# Altium project slave-12-ltc6811-1.PrjPcb (part 2 of 4)

## Sheet feedback.SchDoc: foxBMS BMS-Slave 12-Cell
size A3; DocumentNumber: 8; SheetNumber: 8; SheetTotal: 21; AUTHOR: Fraunhofer IISB foxBMS Team; SheetDescription: Passive Balancing Feedback
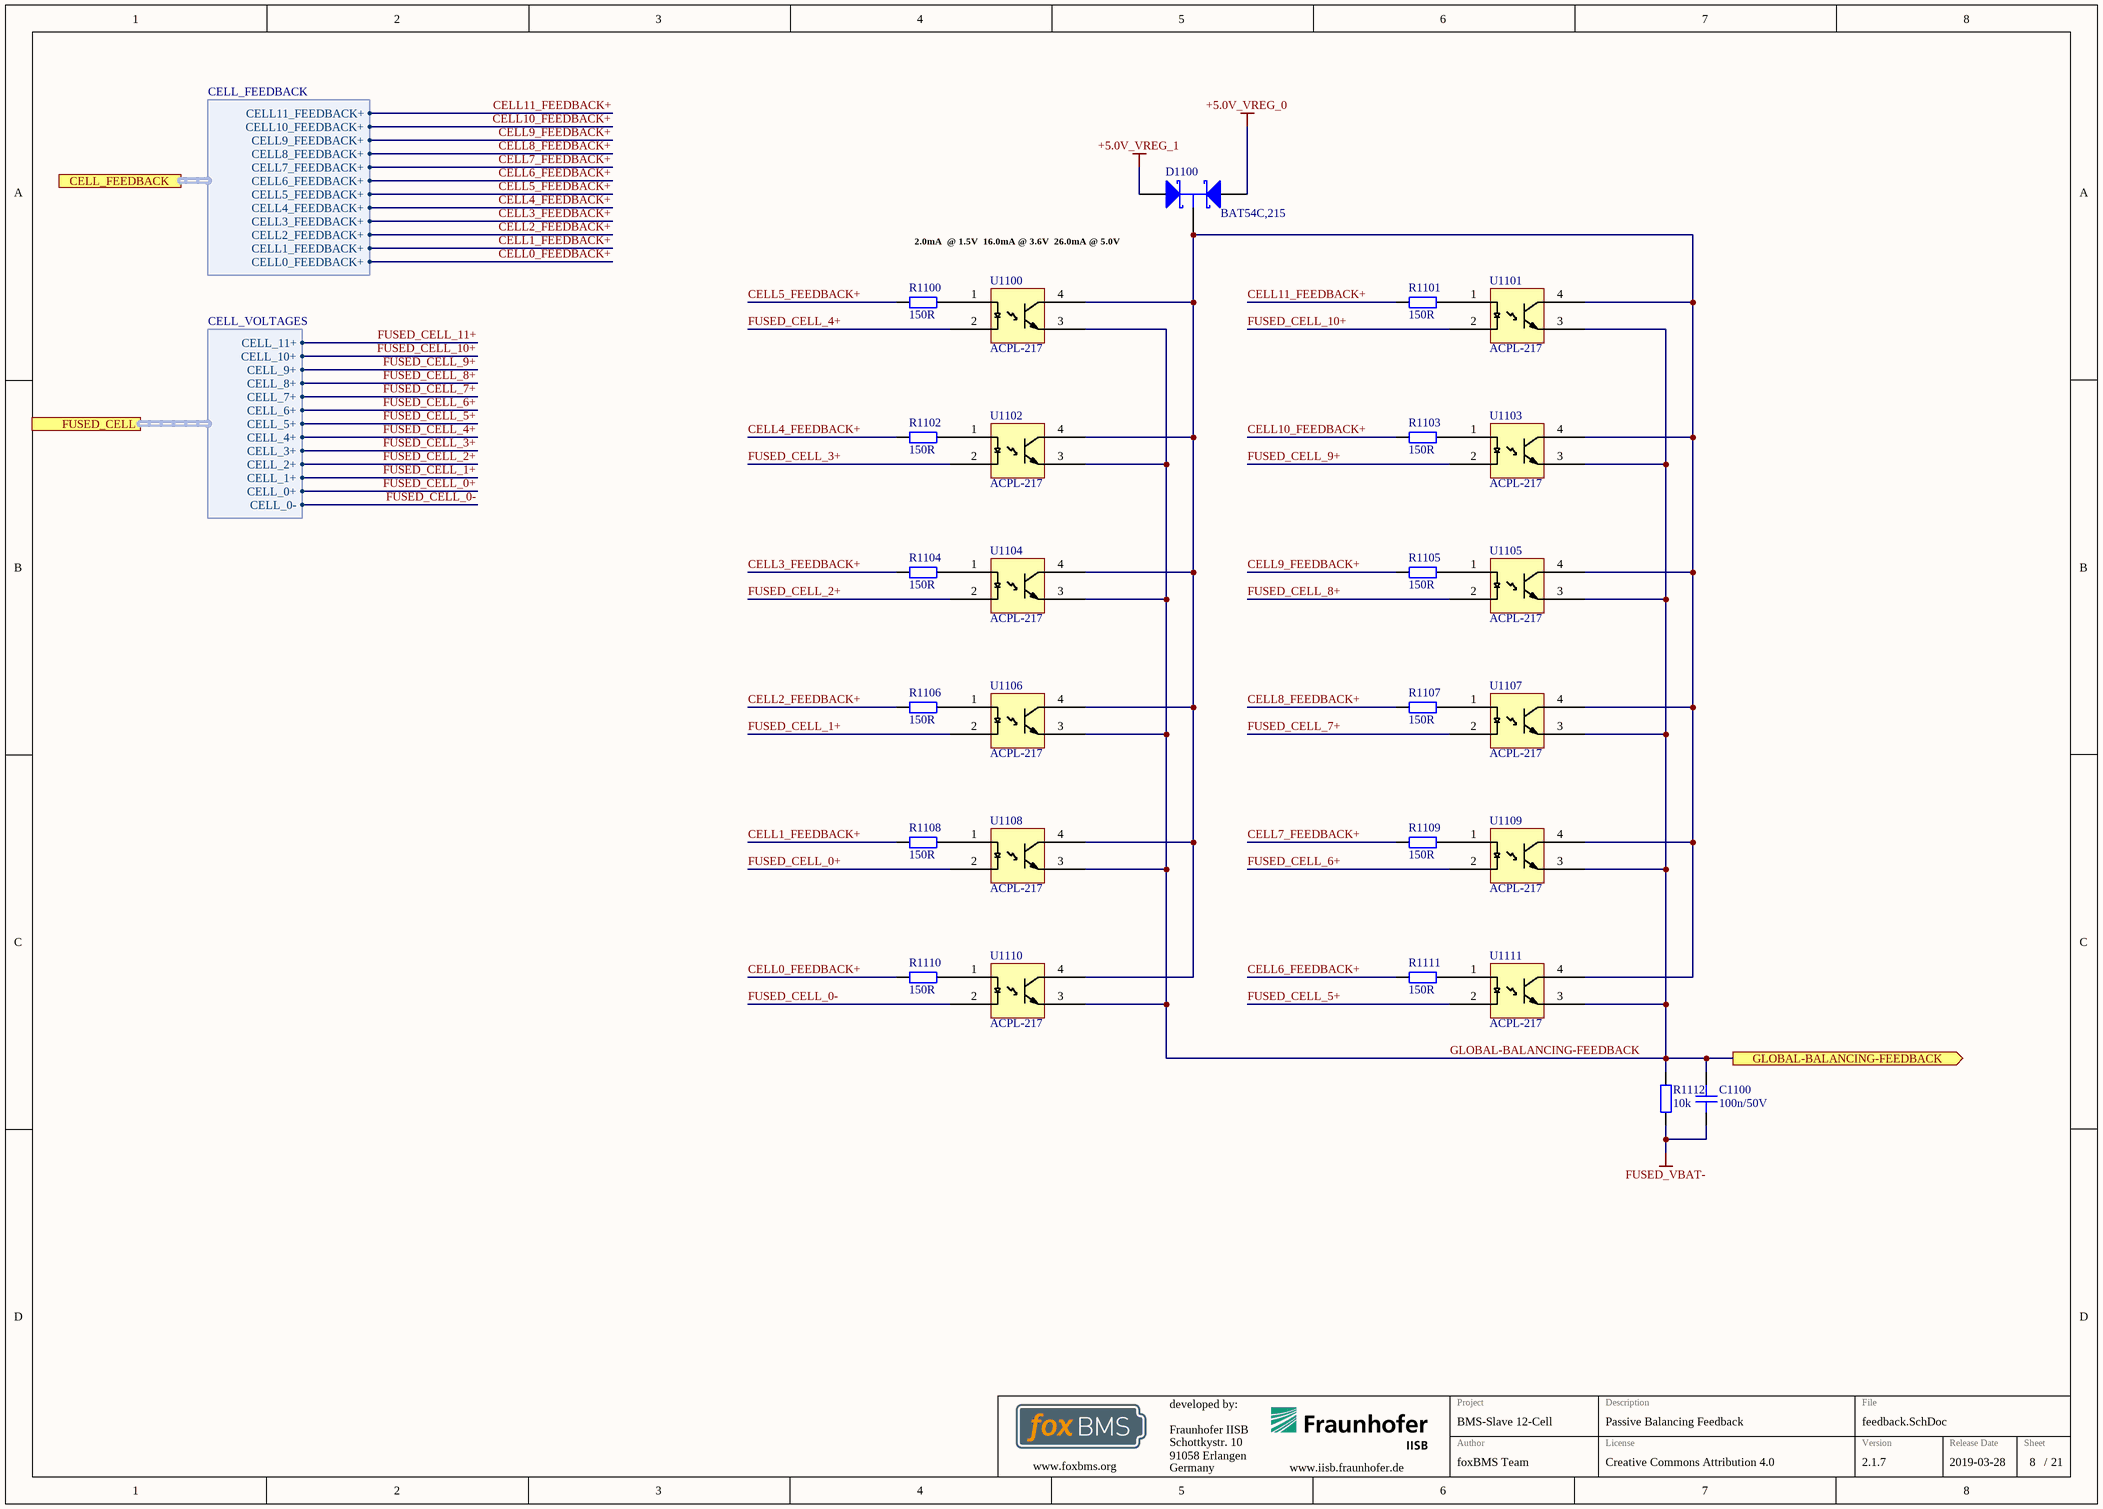
[diagram p6: feedback.SchDoc]

### Parts
C1100  100n/50V  [CAPC1608X08N]
D1100  BAT54C,215  [NXP-SOT23-3_V]
R1100  150R  [RESC1608X05N]
R1101  150R  [RESC1608X05N]
R1102  150R  [RESC1608X05N]
R1103  150R  [RESC1608X05N]
R1104  150R  [RESC1608X05N]
R1105  150R  [RESC1608X05N]
R1106  150R  [RESC1608X05N]
R1107  150R  [RESC1608X05N]
R1108  150R  [RESC1608X05N]
R1109  150R  [RESC1608X05N]
R1110  150R  [RESC1608X05N]
R1111  150R  [RESC1608X05N]
R1112  10k  [RESC1608X05N]
U1100  ACPL-217  [SOIC127P700X220-4N]
U1101  ACPL-217  [SOIC127P700X220-4N]
U1102  ACPL-217  [SOIC127P700X220-4N]
U1103  ACPL-217  [SOIC127P700X220-4N]
U1104  ACPL-217  [SOIC127P700X220-4N]
U1105  ACPL-217  [SOIC127P700X220-4N]
U1106  ACPL-217  [SOIC127P700X220-4N]
U1107  ACPL-217  [SOIC127P700X220-4N]
U1108  ACPL-217  [SOIC127P700X220-4N]
U1109  ACPL-217  [SOIC127P700X220-4N]
U1110  ACPL-217  [SOIC127P700X220-4N]
U1111  ACPL-217  [SOIC127P700X220-4N]

### Ports
CELL_FEEDBACK (harness CELL_FEEDBACK), FUSED_CELL (harness CELL_VOLTAGES), GLOBAL-BALANCING-FEEDBACK (out)

### Harnesses
CELL_FEEDBACK: CELL11_FEEDBACK+, CELL10_FEEDBACK+, CELL9_FEEDBACK+, CELL8_FEEDBACK+, CELL7_FEEDBACK+, CELL6_FEEDBACK+, CELL5_FEEDBACK+, CELL4_FEEDBACK+, CELL3_FEEDBACK+, CELL2_FEEDBACK+, CELL1_FEEDBACK+, CELL0_FEEDBACK+
CELL_VOLTAGES: CELL_0-, CELL_0+, CELL_1+, CELL_10+, CELL_11+, CELL_2+, CELL_3+, CELL_4+, CELL_5+, CELL_6+, CELL_7+, CELL_8+, CELL_9+

### Nets
+5.0V_VREG_0: D1100.2(A)
+5.0V_VREG_1: D1100.1(A)
FUSED_VBAT-: C1100.1 R1112.2
CELL0_FEEDBACK+: R1110.1 ; port CELL_FEEDBACK.CELL0_FEEDBACK+
CELL1_FEEDBACK+: R1108.1 ; port CELL_FEEDBACK.CELL1_FEEDBACK+
CELL2_FEEDBACK+: R1106.1 ; port CELL_FEEDBACK.CELL2_FEEDBACK+
CELL3_FEEDBACK+: R1104.1 ; port CELL_FEEDBACK.CELL3_FEEDBACK+
CELL4_FEEDBACK+: R1102.1 ; port CELL_FEEDBACK.CELL4_FEEDBACK+
CELL5_FEEDBACK+: R1100.1 ; port CELL_FEEDBACK.CELL5_FEEDBACK+
CELL6_FEEDBACK+: R1111.1 ; port CELL_FEEDBACK.CELL6_FEEDBACK+
CELL7_FEEDBACK+: R1109.1 ; port CELL_FEEDBACK.CELL7_FEEDBACK+
CELL8_FEEDBACK+: R1107.1 ; port CELL_FEEDBACK.CELL8_FEEDBACK+
CELL9_FEEDBACK+: R1105.1 ; port CELL_FEEDBACK.CELL9_FEEDBACK+
CELL10_FEEDBACK+: R1103.1 ; port CELL_FEEDBACK.CELL10_FEEDBACK+
CELL11_FEEDBACK+: R1101.1 ; port CELL_FEEDBACK.CELL11_FEEDBACK+
FUSED_CELL_0+: U1108.2 ; port FUSED_CELL.CELL_0+
FUSED_CELL_0-: U1110.2 ; port FUSED_CELL.CELL_0-
FUSED_CELL_1+: U1106.2 ; port FUSED_CELL.CELL_1+
FUSED_CELL_2+: U1104.2 ; port FUSED_CELL.CELL_2+
FUSED_CELL_3+: U1102.2 ; port FUSED_CELL.CELL_3+
FUSED_CELL_4+: U1100.2 ; port FUSED_CELL.CELL_4+
FUSED_CELL_5+: U1111.2 ; port FUSED_CELL.CELL_5+
FUSED_CELL_6+: U1109.2 ; port FUSED_CELL.CELL_6+
FUSED_CELL_7+: U1107.2 ; port FUSED_CELL.CELL_7+
FUSED_CELL_8+: U1105.2 ; port FUSED_CELL.CELL_8+
FUSED_CELL_9+: U1103.2 ; port FUSED_CELL.CELL_9+
FUSED_CELL_10+: U1101.2 ; port FUSED_CELL.CELL_10+
GLOBAL-BALANCING-FEEDBACK: C1100.2 R1112.1 U1100.3 U1101.3 U1102.3 U1103.3 U1104.3 U1105.3 U1106.3 U1107.3 U1108.3 U1109.3 U1110.3 U1111.3 ; port GLOBAL-BALANCING-FEEDBACK
NetD1100_3: D1100.3(K) U1100.4 U1101.4 U1102.4 U1103.4 U1104.4 U1105.4 U1106.4 U1107.4 U1108.4 U1109.4 U1110.4 U1111.4
NetR1100_2: R1100.2 U1100.1
NetR1101_2: R1101.2 U1101.1
NetR1102_2: R1102.2 U1102.1
NetR1103_2: R1103.2 U1103.1
NetR1104_2: R1104.2 U1104.1
NetR1105_2: R1105.2 U1105.1
NetR1106_2: R1106.2 U1106.1
NetR1107_2: R1107.2 U1107.1
NetR1108_2: R1108.2 U1108.1
NetR1109_2: R1109.2 U1109.1
NetR1110_2: R1110.2 U1110.1
NetR1111_2: R1111.2 U1111.1

### Notes on the sheet
- 2.0mA  @ 1.5V
  16.0mA @ 3.6V
  26.0mA @ 5.0V
- Fraunhofer IISB
- Schottkystr. 10
- developed by:
- 91058 Erlangen
- Germany
- Author
- Project
- License
- Description
- File
- Version
- Release Date
- Sheet
- www.foxbms.org
- www.iisb.fraunhofer.de
- foxBMS Team
- /

### Library data of the parts
C1100 = gen_C_ceramic_100n_50V_X7R_0603: MLCC; Capacitance: 100n; Rated Voltage: 50V; Dielectric: X7R; Case EIA: 0603; Case Metric: 1608; PnP Package: C_0603_10; PnP Value: 100n/50V/X7R; PnP equipped: x; Automotive Qualified: False; Part Number: gen_C_ceramic_100n_50V_X7R_0603; Supplier 1: Farnell; Supplier Part Number 1: 2525267; Supplier 2: Digikey; Supplier Part Number 2: 490-6049-1-ND
D1100 = CMP-2000-04915-1: Schottky Barrier Diode, 30 V, 3-Pin SOT23, RoHS, Tape and Reel; Manufacturer: NXP Semiconductors; Forward Surge Current Ifsm Max: 600mA; Pin Configuration: 1A1,2A2,3comK; Package Version: Feb-16; Forward Voltage VF Max: 800mV; SMD Marking: L43/*W1; Diode Case Style: SOT-23; Reverse Recovery Time trr Typ: 5ns; Forward Current If(AV): 200mA; Reel Quantity: 3000; SVHC: NoSVHC(19-Dec-2012); No. of Pins: 3; Junction Temperature Tj Max: 125degC; Common Connection: Cathode; Repetitive Reverse Voltage Vrrm Max: 30V; Operating Temperature Max: 150degC; Operating Temperature Range: -65degCto+150degC; Termination Type: SMD; Package Description: 3-Pin Small Outline Transistor, Body 1.3 x 2.9 mm, Pitch 0.95 mm; Package / Case: SOT-23; Diode Type: Schottky; Manufacturer URL: http://www.nxp.com/; Tape Width: 8mm; Package Reference: SOT23-3; Datasheet URL: https://datasheet.ciiva.com/33723/1668625-33723936.pdf; Datasheet Version: Rev. 5 , 10/2012; Operating Temperature Min: -65degC; Current Ifsm: 600mA; Reverse Recovery Time trr Max: 5ns; Package URL: http://www.nxp.com/documents/outline_drawing/SOT23.pdf; Forward Voltage: 800mV
R1100-R1111 = gen_R_150R_0603: SMD Resistor 150R 0603; Tolerance: 1%; Power: 0.1W; Case EIA: 0603; Case Metric: 1608; Maximum Working Voltage: 75V; PnP Package: R_0603; Automotive Qualified: False; Part Number: gen_R_150R_0603; Operating Temperature: -55°C - +155°C; Resistance: 150R; Series: E24, E96; PnP Value: 150R; Supplier 1: Farnell; Supplier Part Number 1: 1469760
R1112 = gen_R_10k_0603: as R904 on sheet ext_supply; Part Number: gen_R_10k_0603; Operating Temperature: -55°C - +155°C; Resistance: 10k; Series: E24, E96; PnP Value: 10k; Supplier 1: Farnell; Supplier Part Number 1: 2073349
U1100-U1111 = ACPL-217-56BE: Optocoupler, Transistor Output, 1 Channel; Manufacturer: Broadcom Limited; Automotive Qualified: False; Part Number: ACPL-217-56BE; Part Name: ACPL-217; Operating Temperature: -55°C - +110°C; ComponentLink1Description: Datenblatt; ComponentLink1URL: http://www.farnell.com/datasheets/45634.pdf; Supplier 1: Farnell; Supplier Part Number 1: 1602623

## Sheet passive_balancing.SchDoc: foxBMS BMS-Slave 12-Cell
size A3; DocumentNumber: 9; SheetNumber: 9; SheetTotal: 21; AUTHOR: Fraunhofer IISB foxBMS Team; SheetDescription: Passive Cell Balancing
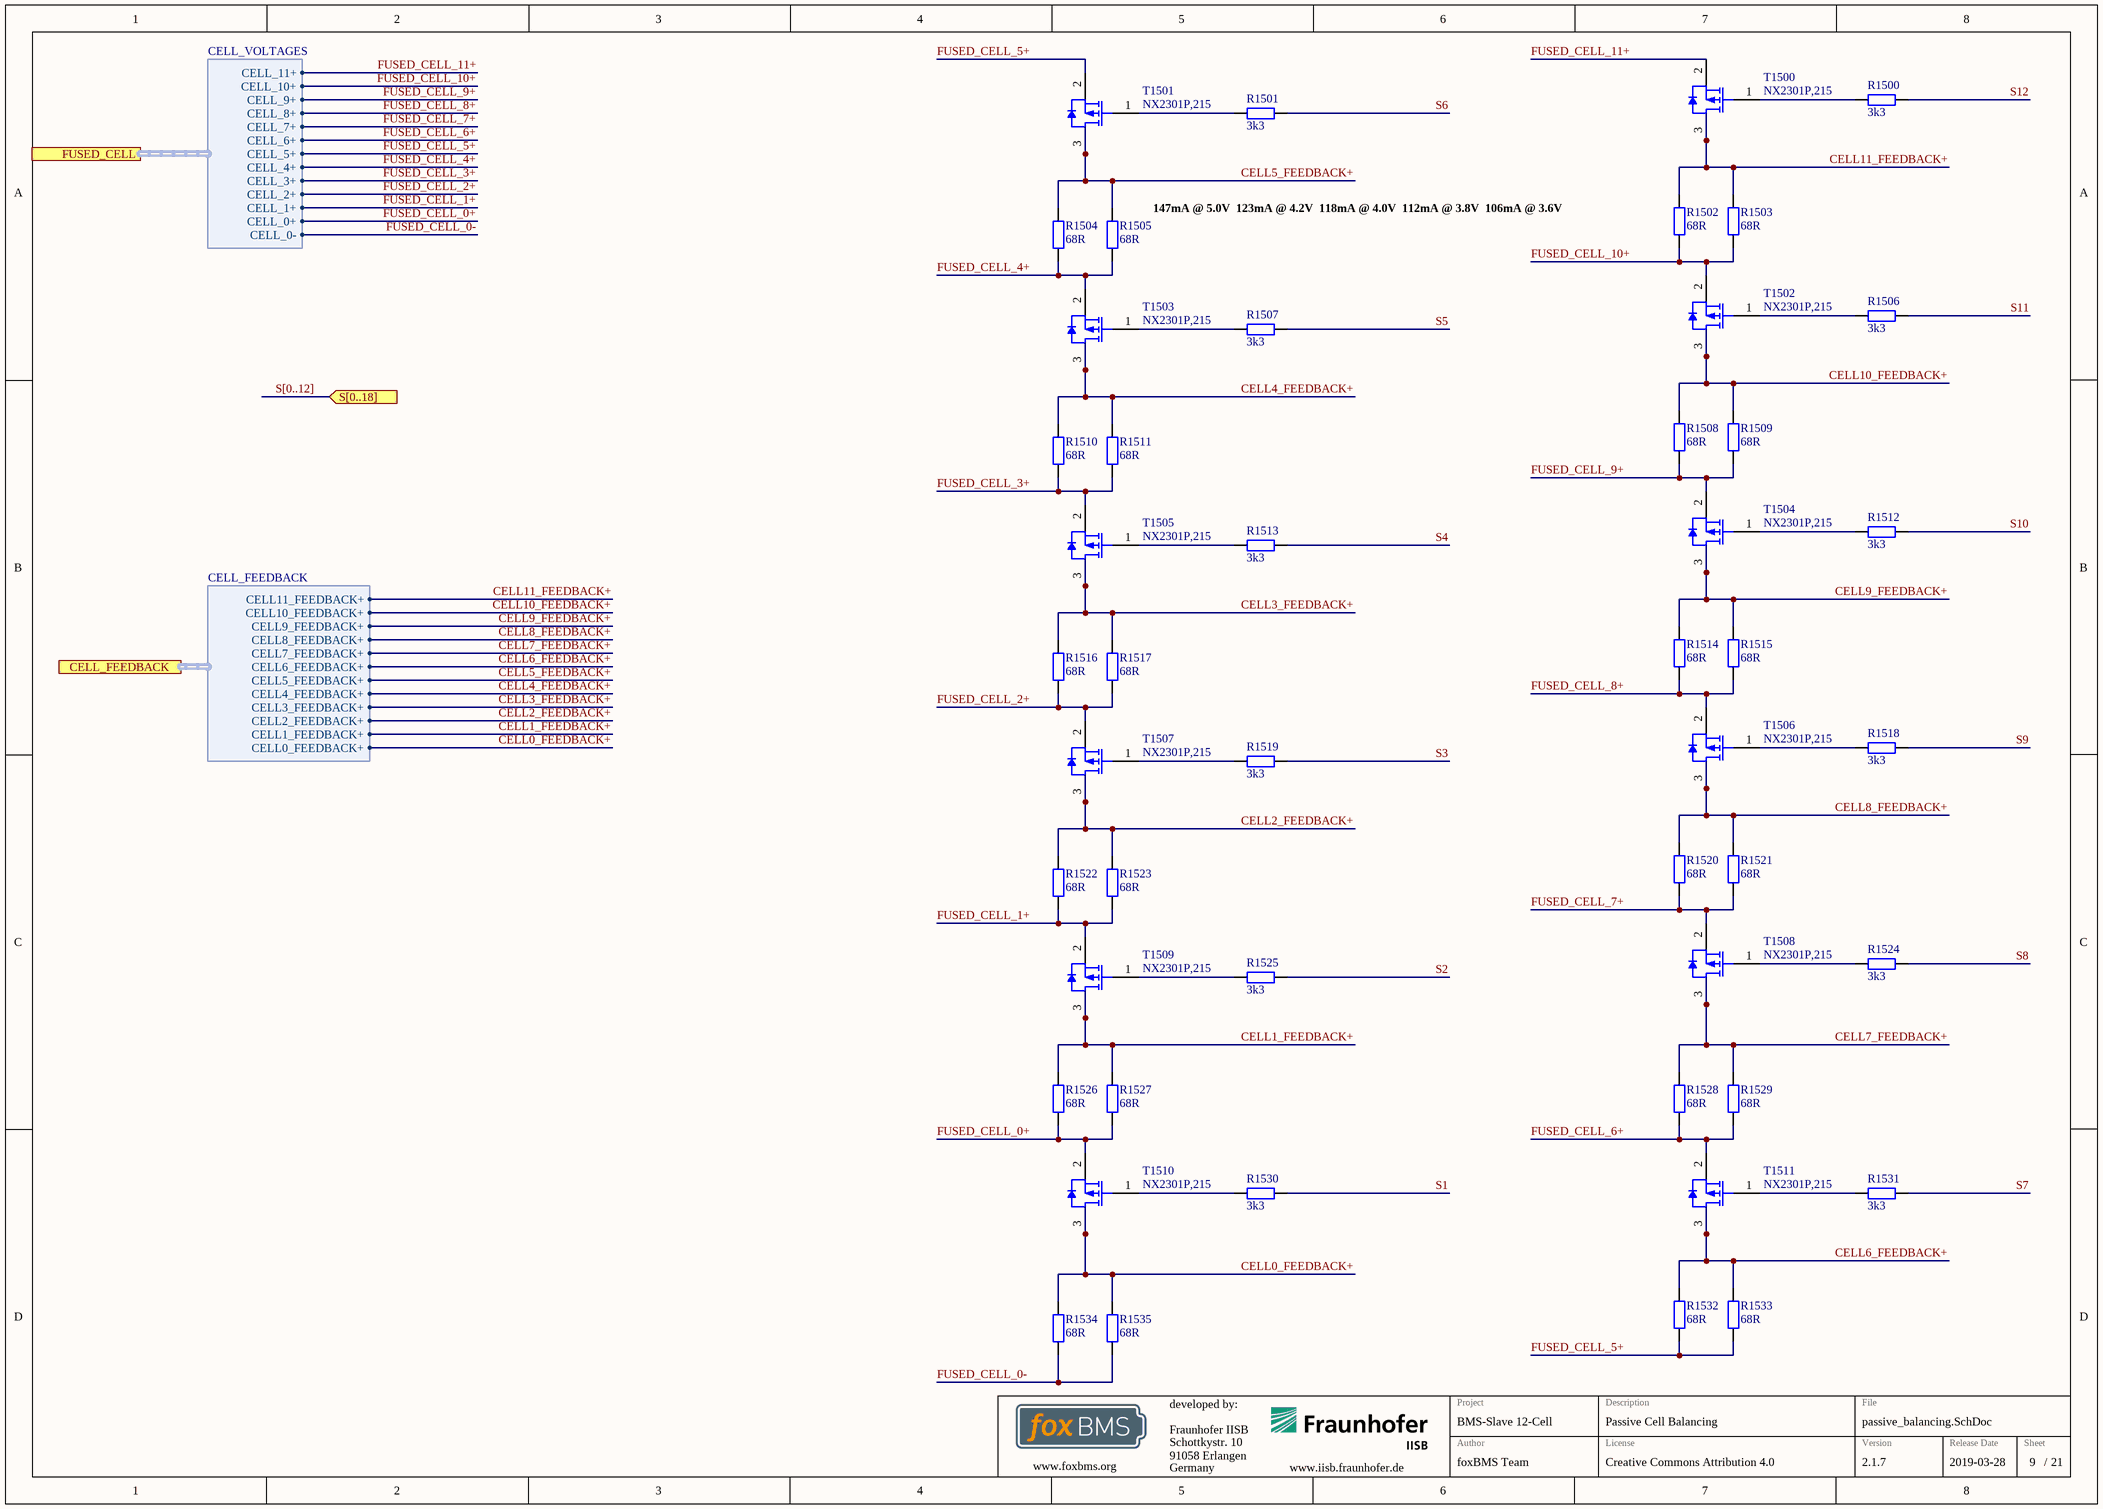
[diagram p7: passive_balancing.SchDoc]

### Parts
R1500  3k3  [RESC1608X05N]
R1501  3k3  [RESC1608X05N]
R1502  68R  [RESC5025X07N]
R1503  68R  [RESC5025X07N]
R1504  68R  [RESC5025X07N]
R1505  68R  [RESC5025X07N]
R1506  3k3  [RESC1608X05N]
R1507  3k3  [RESC1608X05N]
R1508  68R  [RESC5025X07N]
R1509  68R  [RESC5025X07N]
R1510  68R  [RESC5025X07N]
R1511  68R  [RESC5025X07N]
R1512  3k3  [RESC1608X05N]
R1513  3k3  [RESC1608X05N]
R1514  68R  [RESC5025X07N]
R1515  68R  [RESC5025X07N]
R1516  68R  [RESC5025X07N]
R1517  68R  [RESC5025X07N]
R1518  3k3  [RESC1608X05N]
R1519  3k3  [RESC1608X05N]
R1520  68R  [RESC5025X07N]
R1521  68R  [RESC5025X07N]
R1522  68R  [RESC5025X07N]
R1523  68R  [RESC5025X07N]
R1524  3k3  [RESC1608X05N]
R1525  3k3  [RESC1608X05N]
R1526  68R  [RESC5025X07N]
R1527  68R  [RESC5025X07N]
R1528  68R  [RESC5025X07N]
R1529  68R  [RESC5025X07N]
R1530  3k3  [RESC1608X05N]
R1531  3k3  [RESC1608X05N]
R1532  68R  [RESC5025X07N]
R1533  68R  [RESC5025X07N]
R1534  68R  [RESC5025X07N]
R1535  68R  [RESC5025X07N]
T1500  NX2301P,215  [NXP-SOT23_N]
T1501  NX2301P,215  [NXP-SOT23_N]
T1502  NX2301P,215  [NXP-SOT23_N]
T1503  NX2301P,215  [NXP-SOT23_N]
T1504  NX2301P,215  [NXP-SOT23_N]
T1505  NX2301P,215  [NXP-SOT23_N]
T1506  NX2301P,215  [NXP-SOT23_N]
T1507  NX2301P,215  [NXP-SOT23_N]
T1508  NX2301P,215  [NXP-SOT23_N]
T1509  NX2301P,215  [NXP-SOT23_N]
T1510  NX2301P,215  [NXP-SOT23_N]
T1511  NX2301P,215  [NXP-SOT23_N]

### Ports
CELL_FEEDBACK (harness CELL_FEEDBACK), FUSED_CELL (harness CELL_VOLTAGES), S[0..18] (in)

### Harnesses
CELL_VOLTAGES: CELL_0-, CELL_0+, CELL_1+, CELL_10+, CELL_11+, CELL_2+, CELL_3+, CELL_4+, CELL_5+, CELL_6+, CELL_7+, CELL_8+, CELL_9+
CELL_FEEDBACK: CELL11_FEEDBACK+, CELL10_FEEDBACK+, CELL9_FEEDBACK+, CELL8_FEEDBACK+, CELL7_FEEDBACK+, CELL6_FEEDBACK+, CELL5_FEEDBACK+, CELL4_FEEDBACK+, CELL3_FEEDBACK+, CELL2_FEEDBACK+, CELL1_FEEDBACK+, CELL0_FEEDBACK+

### Nets
CELL0_FEEDBACK+: R1534.2 R1535.2 T1510.3(D) ; port CELL_FEEDBACK.CELL0_FEEDBACK+
CELL1_FEEDBACK+: R1526.2 R1527.2 T1509.3(D) ; port CELL_FEEDBACK.CELL1_FEEDBACK+
CELL2_FEEDBACK+: R1522.2 R1523.2 T1507.3(D) ; port CELL_FEEDBACK.CELL2_FEEDBACK+
CELL3_FEEDBACK+: R1516.2 R1517.2 T1505.3(D) ; port CELL_FEEDBACK.CELL3_FEEDBACK+
CELL4_FEEDBACK+: R1510.2 R1511.2 T1503.3(D) ; port CELL_FEEDBACK.CELL4_FEEDBACK+
CELL5_FEEDBACK+: R1504.2 R1505.2 T1501.3(D) ; port CELL_FEEDBACK.CELL5_FEEDBACK+
CELL6_FEEDBACK+: R1532.2 R1533.2 T1511.3(D) ; port CELL_FEEDBACK.CELL6_FEEDBACK+
CELL7_FEEDBACK+: R1528.2 R1529.2 T1508.3(D) ; port CELL_FEEDBACK.CELL7_FEEDBACK+
CELL8_FEEDBACK+: R1520.2 R1521.2 T1506.3(D) ; port CELL_FEEDBACK.CELL8_FEEDBACK+
CELL9_FEEDBACK+: R1514.2 R1515.2 T1504.3(D) ; port CELL_FEEDBACK.CELL9_FEEDBACK+
CELL10_FEEDBACK+: R1508.2 R1509.2 T1502.3(D) ; port CELL_FEEDBACK.CELL10_FEEDBACK+
CELL11_FEEDBACK+: R1502.2 R1503.2 T1500.3(D) ; port CELL_FEEDBACK.CELL11_FEEDBACK+
FUSED_CELL_0+: R1526.1 R1527.1 T1510.2(S) ; port FUSED_CELL.CELL_0+
FUSED_CELL_0-: R1534.1 R1535.1 ; port FUSED_CELL.CELL_0-
FUSED_CELL_1+: R1522.1 R1523.1 T1509.2(S) ; port FUSED_CELL.CELL_1+
FUSED_CELL_2+: R1516.1 R1517.1 T1507.2(S) ; port FUSED_CELL.CELL_2+
FUSED_CELL_3+: R1510.1 R1511.1 T1505.2(S) ; port FUSED_CELL.CELL_3+
FUSED_CELL_4+: R1504.1 R1505.1 T1503.2(S) ; port FUSED_CELL.CELL_4+
FUSED_CELL_5+: R1532.1 R1533.1 T1501.2(S) ; port FUSED_CELL.CELL_5+
FUSED_CELL_6+: R1528.1 R1529.1 T1511.2(S) ; port FUSED_CELL.CELL_6+
FUSED_CELL_7+: R1520.1 R1521.1 T1508.2(S) ; port FUSED_CELL.CELL_7+
FUSED_CELL_8+: R1514.1 R1515.1 T1506.2(S) ; port FUSED_CELL.CELL_8+
FUSED_CELL_9+: R1508.1 R1509.1 T1504.2(S) ; port FUSED_CELL.CELL_9+
FUSED_CELL_10+: R1502.1 R1503.1 T1502.2(S) ; port FUSED_CELL.CELL_10+
FUSED_CELL_11+: T1500.2(S) ; port FUSED_CELL.CELL_11+
S1: R1530.2
S2: R1525.2
S3: R1519.2
S4: R1513.2
S5: R1507.2
S6: R1501.2
S7: R1531.2
S8: R1524.2
S9: R1518.2
S10: R1512.2
S11: R1506.2
S12: R1500.2
NetR1500_1: R1500.1 T1500.1(G)
NetR1501_1: R1501.1 T1501.1(G)
NetR1506_1: R1506.1 T1502.1(G)
NetR1507_1: R1507.1 T1503.1(G)
NetR1512_1: R1512.1 T1504.1(G)
NetR1513_1: R1513.1 T1505.1(G)
NetR1518_1: R1518.1 T1506.1(G)
NetR1519_1: R1519.1 T1507.1(G)
NetR1524_1: R1524.1 T1508.1(G)
NetR1525_1: R1525.1 T1509.1(G)
NetR1530_1: R1530.1 T1510.1(G)
NetR1531_1: R1531.1 T1511.1(G)

### Buses and harness runs
bus S[0..12] = port S[0..18]

### Notes on the sheet
- (near R1505) 147mA @ 5.0V
  123mA @ 4.2V
  118mA @ 4.0V
  112mA @ 3.8V
  106mA @ 3.6V
- Fraunhofer IISB
- Schottkystr. 10
- developed by:
- 91058 Erlangen
- Germany
- Author
- Project
- License
- Description
- File
- Version
- Release Date
- Sheet
- www.foxbms.org
- www.iisb.fraunhofer.de
- foxBMS Team
- /

### Library data of the parts
R1500 R1501 R1506 R1507 R1512 R1513 R1518 R1519 R1524 R1525 R1530 R1531 = gen_R_3k3_0603: SMD Resistor 3k3 0603; Tolerance: 1%; Power: 0.1W; Case EIA: 0603; Case Metric: 1608; Maximum Working Voltage: 75V; PnP Package: R_0603; Automotive Qualified: False; Part Number: gen_R_3k3_0603; Operating Temperature: -55°C - +155°C; Resistance: 3k3; Series: E24; PnP Value: 3k3; Supplier 1: Farnell; Supplier Part Number 1: 1469793
R1502-R1505 R1508-R1511 R1514-R1517 R1520-R1523 R1526-R1529 R1532-R1535 = gen_R_68R_2010: SMD Resistor 68R 2010; Tolerance: 1%; Power: 0.75W; Case EIA: 2010; Case Metric: 5025; Maximum Working Voltage: 200V; PnP Package: R_2010; Automotive Qualified: False; Part Number: gen_R_68R_2010; Operating Temperature: -55°C - +155°C; Resistance: 68R; Series: E24; PnP Value: 68R; Supplier 1: Farnell; Supplier Part Number 1: 2323988
T1500-T1511 = CMP-1259-00090-1: P-Channel Trench MOSFET, -20 V, -2 A, -55 to 150 degC, 3-Pin SOT23, Tape and Reel; Manufacturer: NXP Semiconductors; VGSth [typ] (V): -0.75; Channel Type: P; Packing: Tape & Reel; Automotive Qualified: Y; IDM [max] (A): -6; PackageReference: SOT23; PartNumber: NX2301P,215; PackageVersion: 06-03-16, 03/2006; ComponentLink1URL: http://www.nxp.com/; ID [max] (A): -2; Mounting Technology: Surface Mount; ComponentLink1Description: Manufacturer URL; VDS [max] (V): -20; Code_JEDEC: TO-236AB; DatasheetVersion: Rev. 1; ComponentLink3URL: http://www.nxp.com/documents/outline_drawing/sot023_po.pdf; ComponentLink2Description: Datasheet; PackageDescription: 3-Pin Small Outline Transistor Package, Body 2.9 x 1.3 mm, Pitch 0.95 mm; ComponentLink3Description: Package Specification; ComponentLink2URL: http://www.nxp.com/documents/data_sheet/NX2301P.pdf

## Sheet primary_LTC.SchDoc: foxBMS BMS-Slave 12-Cell
size A3; DocumentNumber: 15; SheetNumber: 15; SheetTotal: 21; AUTHOR: Fraunhofer IISB foxBMS Team; SheetDescription: Primary LTC6811
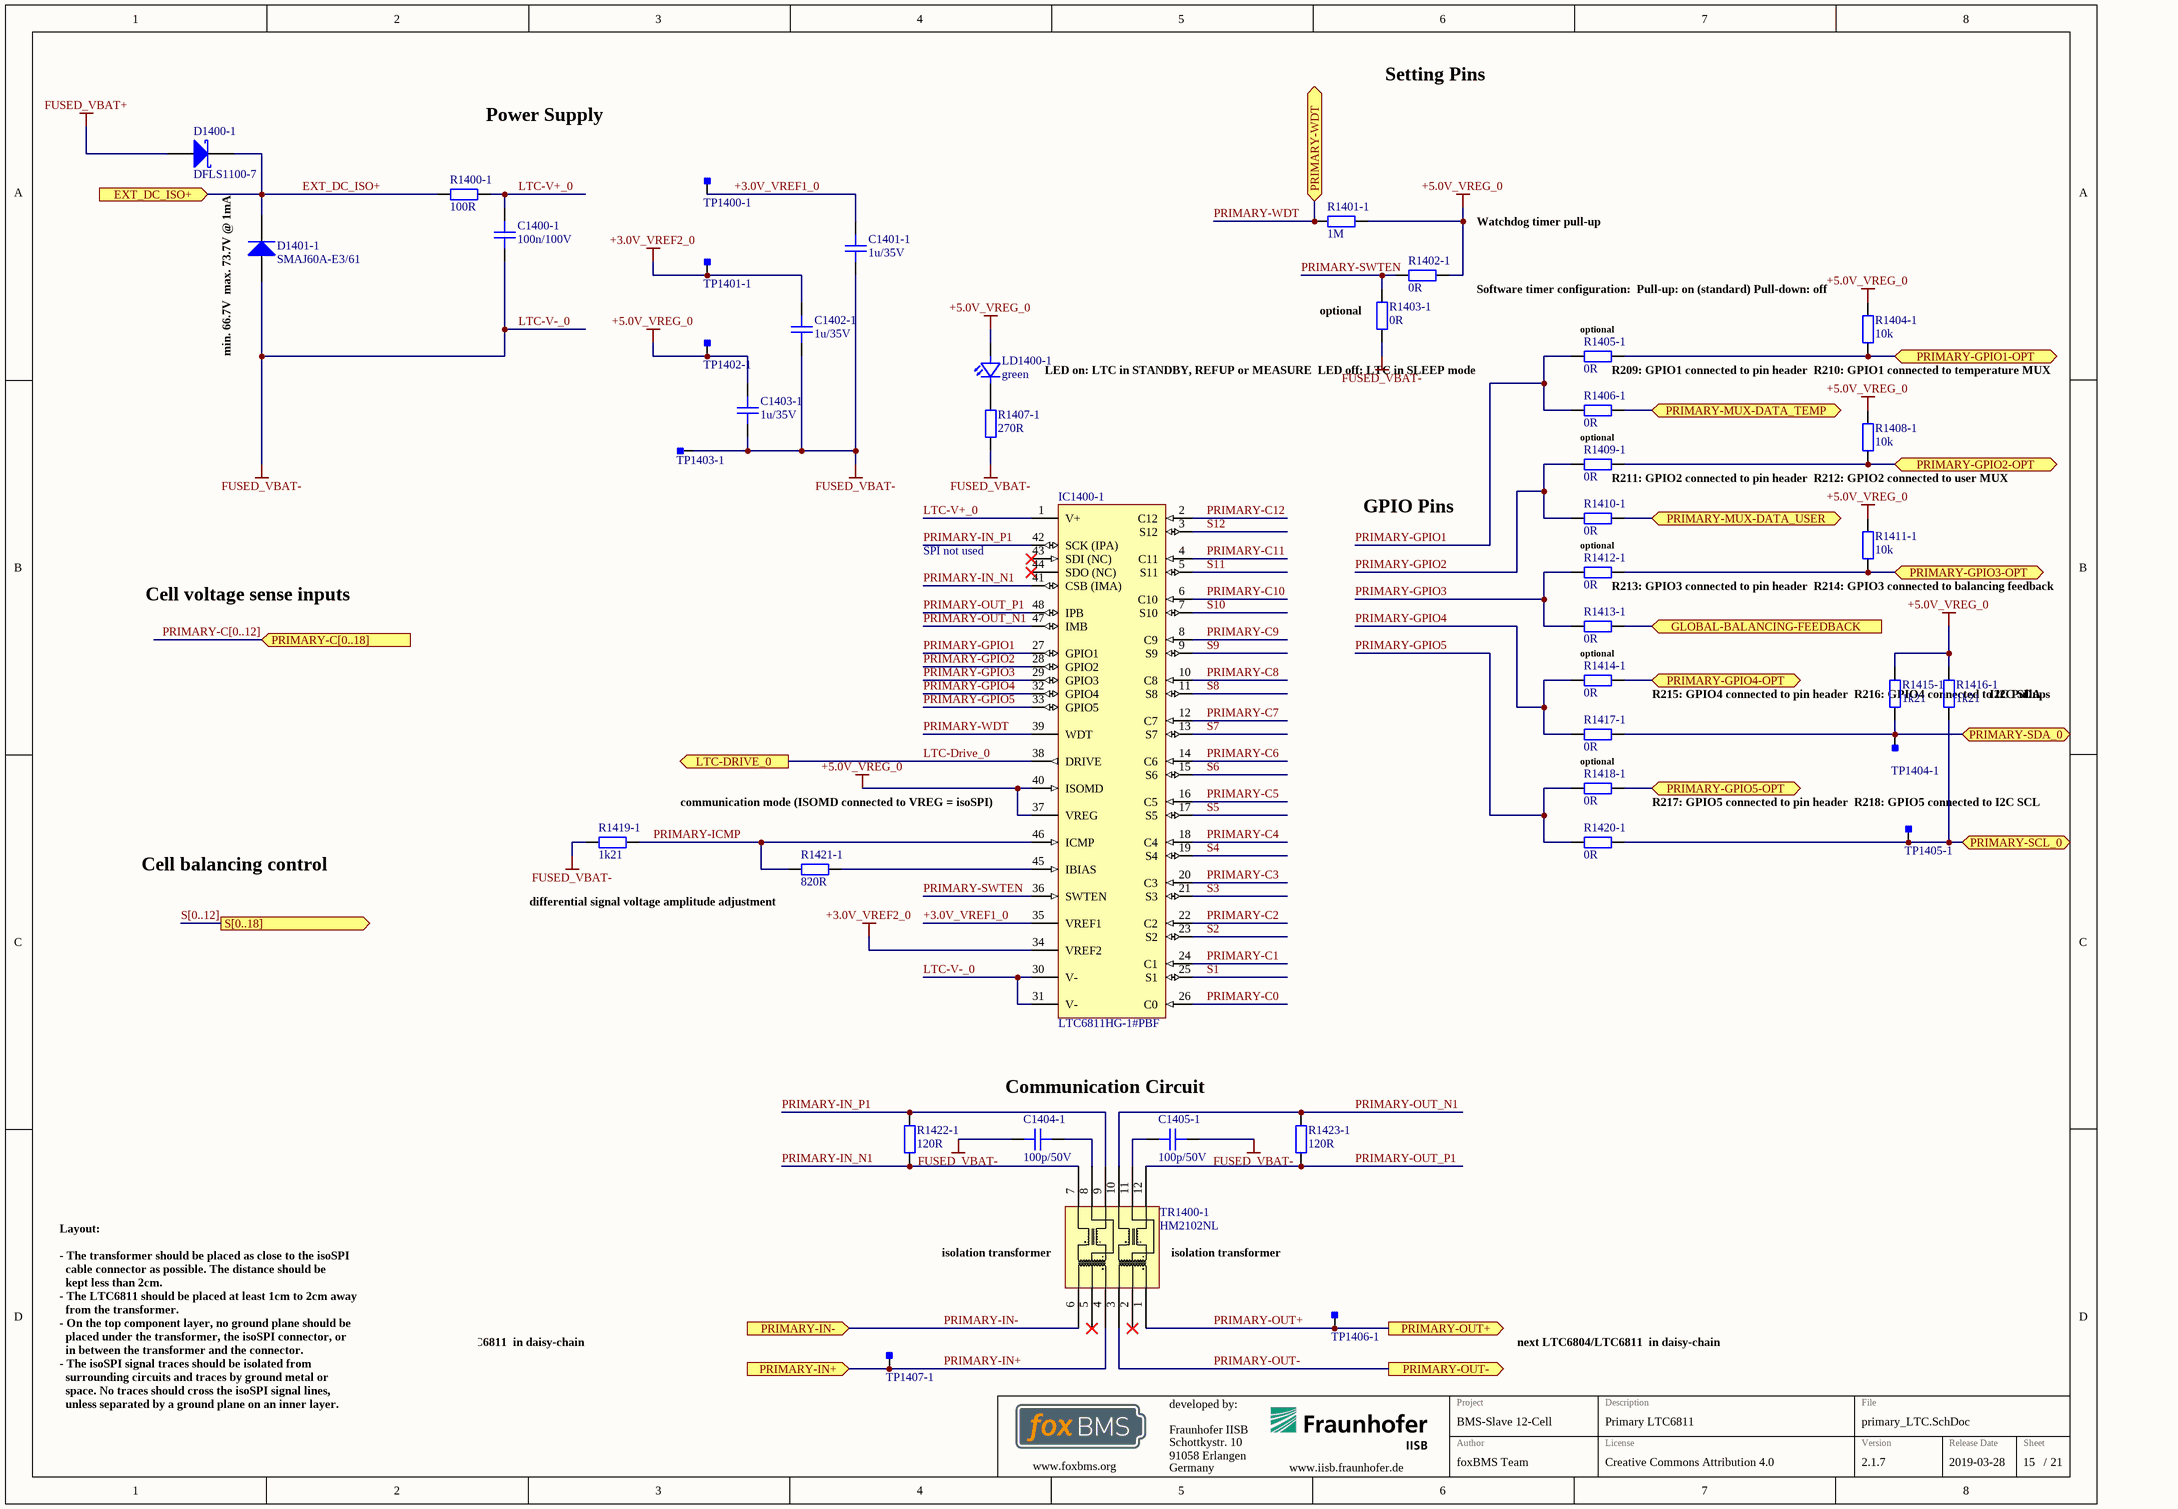
[diagram p8: primary_LTC.SchDoc]

### Parts
C1400-1  100n/100V  [CAPC2012X14N]
C1401-1  1u/35V  [CAPC1608X08N]
C1402-1  1u/35V  [CAPC1608X08N]
C1403-1  1u/35V  [CAPC1608X08N]
C1404-1  100p/50V  [CAPC1608X08N]
C1405-1  100p/50V  [CAPC1608X08N]
D1400-1  DFLS1100-7  [DIOD-POWERDI123-2_V]
D1401-1  SMAJ60A-E3/61  [VISH-DO-214AC-2_N]
IC1400-1  LTC6811HG-1#PBF  [LT-G-48_L]
LD1400-1  green  [LEDC1608X07N]
R1400-1  100R  [RESC2012X05N]
R1401-1  1M  [RESC1608X05N]
R1402-1  0R  [RESC1608X05N]
R1403-1  0R  [RESC1608X05N]
R1404-1  10k  [RESC1608X05N]
R1405-1  0R  [RESC1608X05N]
R1406-1  0R  [RESC1608X05N]
R1407-1  270R  [RESC1608X05N]
R1408-1  10k  [RESC1608X05N]
R1409-1  0R  [RESC1608X05N]
R1410-1  0R  [RESC1608X05N]
R1411-1  10k  [RESC1608X05N]
R1412-1  0R  [RESC1608X05N]
R1413-1  0R  [RESC1608X05N]
R1414-1  0R  [RESC1608X05N]
R1415-1  1k21  [RESC1608X05N]
R1416-1  1k21  [RESC1608X05N]
R1417-1  0R  [RESC1608X05N]
R1418-1  0R  [RESC1608X05N]
R1419-1  1k21  [RESC1608X05N]
R1420-1  0R  [RESC1608X05N]
R1421-1  820R  [RESC1608X05N]
R1422-1  120R  [RESC1608X05N]
R1423-1  120R  [RESC1608X05N]
TP1400-1  Testpoint_Square  [Testpoint_S1]  (value not drawn)  (no BOM)
TP1401-1  Testpoint_Square  [Testpoint_S1]  (value not drawn)  (no BOM)
TP1402-1  Testpoint_Square  [Testpoint_S1]  (value not drawn)  (no BOM)
TP1403-1  Testpoint_Square  [Testpoint_S1]  (value not drawn)  (no BOM)
TP1404-1  Testpoint_Square  [Testpoint_S1]  (value not drawn)  (no BOM)
TP1405-1  Testpoint_Square  [Testpoint_S1]  (value not drawn)  (no BOM)
TP1406-1  Testpoint_Square  [Testpoint_S1]  (value not drawn)  (no BOM)
TP1407-1  Testpoint_Square  [Testpoint_S1]  (value not drawn)  (no BOM)
TR1400-1  HM2102NL  [HM2102NL]

### Ports
EXT_DC_ISO+ (in), GLOBAL-BALANCING-FEEDBACK (in), LTC-DRIVE_0 (out), PRIMARY-C[0..18] (in), PRIMARY-GPIO1-OPT (bidir), PRIMARY-GPIO2-OPT (bidir), PRIMARY-GPIO3-OPT (bidir), PRIMARY-GPIO4-OPT (bidir), PRIMARY-GPIO5-OPT (bidir), PRIMARY-IN+ (in), PRIMARY-IN- (in), PRIMARY-MUX-DATA_TEMP (bidir), PRIMARY-MUX-DATA_USER (bidir), PRIMARY-OUT+ (out), PRIMARY-OUT- (out), PRIMARY-SCL_0 (bidir), PRIMARY-SDA_0 (bidir), PRIMARY-WDT (bidir), S[0..18] (out)

### Nets
+3.0V_VREF2_0: C1402-1.2 IC1400-1.34(VREF2) TP1401-1.1
+5.0V_VREG_0: C1403-1.2 IC1400-1.37(VREG) IC1400-1.40(ISOMD) LD1400-1.2(A) R1401-1.2 R1402-1.2 R1404-1.2 R1408-1.2 R1411-1.2 R1415-1.2 R1416-1.2 TP1402-1.1
FUSED_VBAT+: D1400-1.1(A)
FUSED_VBAT-: C1400-1.2 C1401-1.1 C1402-1.1 C1403-1.1 C1404-1.1 C1405-1.1 D1401-1.2(A) IC1400-1.30(V-) IC1400-1.31(V-) R1403-1.1 R1407-1.1 R1419-1.1 TP1403-1.1  [also labelled LTC-V-_0]
+3.0V_VREF1_0: C1401-1.2 IC1400-1.35(VREF1) TP1400-1.1
EXT_DC_ISO+: D1400-1.2(K) D1401-1.1(K) R1400-1.1 ; port EXT_DC_ISO+
GLOBAL-BALANCING-FEEDBACK: R1413-1.1 ; port GLOBAL-BALANCING-FEEDBACK
LTC-Drive_0: IC1400-1.38(DRIVE) ; port LTC-DRIVE_0
LTC-V+_0: C1400-1.1 IC1400-1.1(V+) R1400-1.2
PRIMARY-C0: IC1400-1.26(C0)
PRIMARY-C1: IC1400-1.24(C1)
PRIMARY-C2: IC1400-1.22(C2)
PRIMARY-C3: IC1400-1.20(C3)
PRIMARY-C4: IC1400-1.18(C4)
PRIMARY-C5: IC1400-1.16(C5)
PRIMARY-C6: IC1400-1.14(C6)
PRIMARY-C7: IC1400-1.12(C7)
PRIMARY-C8: IC1400-1.10(C8)
PRIMARY-C9: IC1400-1.8(C9)
PRIMARY-C10: IC1400-1.6(C10)
PRIMARY-C11: IC1400-1.4(C11)
PRIMARY-C12: IC1400-1.2(C12)
PRIMARY-GPIO1: IC1400-1.27(GPIO1) R1405-1.2 R1406-1.2
PRIMARY-GPIO1-OPT: R1404-1.1 R1405-1.1 ; port PRIMARY-GPIO1-OPT
PRIMARY-GPIO2: IC1400-1.28(GPIO2) R1409-1.2 R1410-1.2
PRIMARY-GPIO2-OPT: R1408-1.1 R1409-1.1 ; port PRIMARY-GPIO2-OPT
PRIMARY-GPIO3: IC1400-1.29(GPIO3) R1412-1.2 R1413-1.2
PRIMARY-GPIO3-OPT: R1411-1.1 R1412-1.1 ; port PRIMARY-GPIO3-OPT
PRIMARY-GPIO4: IC1400-1.32(GPIO4) R1414-1.2 R1417-1.2
PRIMARY-GPIO4-OPT: R1414-1.1 ; port PRIMARY-GPIO4-OPT
PRIMARY-GPIO5: IC1400-1.33(GPIO5) R1418-1.2 R1420-1.2
PRIMARY-GPIO5-OPT: R1418-1.1 ; port PRIMARY-GPIO5-OPT
PRIMARY-ICMP: IC1400-1.46(ICMP) R1419-1.2 R1421-1.1
PRIMARY-IN+: TP1407-1.1 TR1400-1.4 ; port PRIMARY-IN+
PRIMARY-IN-: TR1400-1.6 ; port PRIMARY-IN-
PRIMARY-IN_N1: IC1400-1.41(CSB_(IMA)) R1422-1.2 TR1400-1.7
PRIMARY-IN_P1: IC1400-1.42(SCK_(IPA)) R1422-1.1 TR1400-1.9
PRIMARY-MUX-DATA_TEMP: R1406-1.1 ; port PRIMARY-MUX-DATA_TEMP
PRIMARY-MUX-DATA_USER: R1410-1.1 ; port PRIMARY-MUX-DATA_USER
PRIMARY-OUT+: TP1406-1.1 TR1400-1.1 ; port PRIMARY-OUT+
PRIMARY-OUT-: TR1400-1.3 ; port PRIMARY-OUT-
PRIMARY-OUT_N1: IC1400-1.47(IMB) R1423-1.2 TR1400-1.10
PRIMARY-OUT_P1: IC1400-1.48(IPB) R1423-1.1 TR1400-1.12
PRIMARY-SCL_0: R1416-1.1 R1420-1.1 TP1405-1.1 ; port PRIMARY-SCL_0
PRIMARY-SDA_0: R1415-1.1 R1417-1.1 TP1404-1.1 ; port PRIMARY-SDA_0
PRIMARY-SWTEN: IC1400-1.36(SWTEN) R1402-1.1 R1403-1.2
PRIMARY-WDT: IC1400-1.39(WDT) R1401-1.1 ; port PRIMARY-WDT
S1: IC1400-1.25(S1)
S2: IC1400-1.23(S2)
S3: IC1400-1.21(S3)
S4: IC1400-1.19(S4)
S5: IC1400-1.17(S5)
S6: IC1400-1.15(S6)
S7: IC1400-1.13(S7)
S8: IC1400-1.11(S8)
S9: IC1400-1.9(S9)
S10: IC1400-1.7(S10)
S11: IC1400-1.5(S11)
S12: IC1400-1.3(S12)
NetC1404-1_2: C1404-1.2 TR1400-1.8
NetC1405-1_2: C1405-1.2 TR1400-1.11
NetIC1400-1_45: IC1400-1.45(IBIAS) R1421-1.2
NetLD1400-1_1: LD1400-1.1(C) R1407-1.2

Not connected (* = marked no-connect by the designer): IC1400-1 43(SDI_(NC))* 44(SDO_(NC))*; TR1400-1 2* 5*

### Buses and harness runs
bus PRIMARY-C[0..12] = port PRIMARY-C[0..18]
bus S[0..12] = port S[0..18]

### Notes on the sheet
- Setting Pins
- Power Supply
- Watchdog timer pull-up
- min. 66.7V
  max. 73.7V @ 1mA
- (near R1403-1) optional
- (near R1404-1) Software timer configuration:
  Pull-up: on (standard)
  Pull-down: off
- LED on: LTC in STANDBY, REFUP or MEASURE
  LED off: LTC in SLEEP mode
- (near R1405-1) optional
- (near R1405-1) R209: GPIO1 connected to pin header
  R210: GPIO1 connected to temperature MUX
- optional
- GPIO Pins
- (near R1409-1) R211: GPIO2 connected to pin header
  R212: GPIO2 connected to user MUX
- SPI not used
- (near R1412-1) R213: GPIO3 connected to pin header
  R214: GPIO3 connected to balancing feedback
- Cell voltage sense inputs
- R215: GPIO4 connected to pin header
  R216: GPIO4 connected to I2C SDA
- (near R1416-1) I2C Pullups
- communication mode (ISOMD connected to VREG = isoSPI)
- (near TP1405-1) R217: GPIO5 connected to pin header
  R218: GPIO5 connected to I2C SCL
- Cell balancing control
- (near R1421-1) differential signal voltage amplitude adjustment
- Communication Circuit
- (near TR1400-1) isolation transformer
- previous LTC6804/LTC6811
  in daisy-chain
- next LTC6804/LTC6811
  in daisy-chain
- Layout:
  - The transformer should be placed as close to the isoSPI
  cable connector as possible. The distance should be
  kept less than 2cm.
  - The LTC6811 should be placed at least 1cm to 2cm away
  from the transformer.
  - On the top component layer, no ground plane should be
  placed under the transformer, the isoSPI connector, or
  in between the transformer and the connector.
  - The isoSPI signal traces should be isolated from
  surrounding circuits and traces by ground metal or
  space. No traces should cross the isoSPI signal lines,
  unless separated by a ground plane on an inner layer.
- Fraunhofer IISB
- Schottkystr. 10
- developed by:
- 91058 Erlangen
- Germany
- Author
- Project
- License
- Description
- File
- Version
- Release Date
- Sheet
- www.foxbms.org
- www.iisb.fraunhofer.de
- foxBMS Team
- /

### Library data of the parts
C1400-1 = gen_C_ceramic_100n_100V_X7R_0805: MLCC; Capacitance: 100n; Rated Voltage: 100V; Dielectric: X7R; Case EIA: 0805; Case Metric: 2012; Automotive Qualified: False; Part Number: gen_C_ceramic_100n_100V_X7R_0805; Supplier 1: Farnell; Supplier Part Number 1: 2320821
C1401-1 C1402-1 C1403-1 = gen_C_ceramic_1u_35V_X7R_0603: MLCC; Capacitance: 1u; Rated Voltage: 35V; Dielectric: X7R; Case EIA: 0603; Case Metric: 1608; PnP Package: C_0603_10; PnP Value: 1uF/35V/X7R; PnP equipped: x; Automotive Qualified: False; Part Number: gen_C_ceramic_1u_35V_X7R_0603; Supplier 1: Farnell; Supplier Part Number 1: 1907508
C1404-1 C1405-1 = gen_C_ceramic_100p_50V_C0G_0603: MLCC; Capacitance: 100p; Rated Voltage: 50V; Dielectric: C0G; Case EIA: 0603; Case Metric: 1608; Automotive Qualified: False; Part Number: gen_C_ceramic_100p_50V_C0G_0603; Supplier 1: Farnell; Supplier Part Number 1: 1414603
D1400-1 = CMP-2000-05099-1: 1 A High Voltage Schottky Barrier Rectifier, 0.62 V, -55 to 175 degC, 2- Pin POWERDI123, Pb-Free, Tape and Reel; Manufacturer: Diodes Inc; Average Rectified Current-Max: 1A; Peak Current-Max: 40A; Forward Voltage: 0.77V; Reverse Current-Max: 1µA; Reverse Voltage-Max [Vrrm]: 100V; Datasheet Version: Sep-14; Datasheet URL: https://datasheet.ciiva.com/15144/getdatasheetpartid-44146-15144126.pdf; Manufacturer URL: http://www.diodes.com/
D1401-1 = CMP-0548-00258-2: Transient Voltage Suppressor, 6.40 to 231 V, 60 V Stand-off Voltage, Uni-Directional, -55 to 155 degC, 2-pin DO-214AC, Pb-Free, Tape and Reel; Manufacturer: Vishay Semiconductor; VWM (V): 60; PPPM (W): 400, 300; VBR Uni-Directional (V): 6.4 to 231; IFSM: 40 A; ID (uA): 1; RoHS: TRUE; ComponentLink3Description: Package Specification; PackageReference: DO-214AC-2; PartNumber: SMAJ60A-E3/61; ComponentLink2Description: Datasheet; ComponentLink2URL: http://www.vishay.com/docs/88390/smaj50a.pdf; ComponentLink3URL: http://www.vishay.com/docs/88390/smaj50a.pdf; Packing: Tape and Reel; ComponentLink1Description: Manufacturer URL; PackageDescription: 2-Pin DO-214AC (SMA), Body 4.245 x 2.665 mm; DatasheetVersion: 12/8/2013; ComponentLink1URL: http://www.vishay.com/; Operating Junction and Storage Temperature Range: -55 to 150 degC; Mounting Technology: Surface Mount
IC1400-1 = LTC6811HG-1#PBF: Multicell Battery Monitor, 60 V Vin MAX, 48-pin SOP (G-48), -40 to 125 degC, Pb-Free; Manufacturer: Linear Technology; Type of Charger: Battery Stack Monitor; Vin Max(V): 60; Battery Chemistry: Li-Ion, Li-Polymer, NiMH; Number of Cells: > 1000 V of stacked Li-Ion cells; Automotive Qualified: False; RoHS: TRUE; ComponentLink1Description: Datasheet; ComponentLink1URL: https://cds.linear.com/docs/en/datasheet/68111fb.pdf; PartNumber: LTC6811HG-1#PBF; PackageReference: G-48; PackageVersion: Rev. Ã˜, 01/2011; ComponentLink2Description: Datasheet; Mounting Technology: Surface Mount; ComponentLink3Description: Package Specification; PackageDescription: 48-Pin Plastic SSOP, Body 12.8 x 5.3 mm, Pitch 0.5 mm; ComponentLink3URL: http://cds.linear.com/docs/en/packaging/05081887_0_G48.pdf; ComponentLink2URL: http://cds.linear.com/docs/en/datasheet/680412f.pdf; Part Number: LTC6811HG-1#PBF; Part Name: LTC6811HG-1#PBF; Operating Temperature: -40°C - +125°C; Supplier 1: Digikey; Supplier Part Number 1: LTC6811HG-1#PBF-ND
LD1400-1 = gen_LED_0603_green: LED; Breakdown Voltage: 5V; Continuous Forward Current: 20mA; Forward Voltage @ 20mA: 2.2V; Automotive Qualified: False; Part Number: gen_LED_0603_green; Color: green; Supplier 1: Farnell; Supplier Part Number 1: 2099223; PnP Package: LED_0603
R1400-1 = gen_R_100R_0805: SMD Resistor 100R 0805; Tolerance: 1%; Power: 0.125W; Case EIA: 0805; Case Metric: 2012; Maximum Working Voltage: 150V; PnP Package: R_0805; Automotive Qualified: False; Part Number: gen_R_100R_0805; Operating Temperature: -55°C - +155°C; Resistance: 100R; Series: E24, E96; PnP Value: 100R; Supplier 1: Farnell; Supplier Part Number 1: 1469862
R1401-1 = gen_R_1M_0603: SMD Resistor 1M 0603; Tolerance: 1%; Power: 0.1W; Case EIA: 0603; Case Metric: 1608; Maximum Working Voltage: 75V; PnP Package: R_0603; Automotive Qualified: False; Part Number: gen_R_1M_0603; Operating Temperature: -55°C - +155°C; Resistance: 1M; Series: E24, E96; PnP Value: 1M; Supplier 1: Farnell; Supplier Part Number 1: 1469746
R1402-1 R1403-1 R1405-1 R1406-1 R1409-1 R1410-1 R1412-1 R1413-1 R1414-1 R1417-1 R1418-1 R1420-1 = gen_R_0R_0603: SMD Resistor 0R 0603; Power: 0.1W; Case EIA: 0603; Case Metric: 1608; Maximum Working Voltage: 75V; PnP Package: R_0603; Automotive Qualified: False; Part Number: gen_R_0R_0603; Operating Temperature: -55°C - +155°C; Resistance: 0R; Series: Jumper; PnP Value: 0R; Supplier 1: Farnell; Supplier Part Number 1: 2073345
R1404-1 R1408-1 R1411-1 = gen_R_10k_0603: SMD Resistor 10k 0603; Tolerance: 1%; Power: 0.1W; Case EIA: 0603; Case Metric: 1608; Maximum Working Voltage: 75V; PnP Package: R_0603; Automotive Qualified: True; Part Number: gen_R_10k_0603; Operating Temperature: -55°C - +155°C; Resistance: 10k; Series: E24, E96; PnP Value: 10k; Supplier 1: Farnell; Supplier Part Number 1: 2073349
R1407-1 = gen_R_270R_0603: SMD Resistor 270R 0603; Tolerance: 1%; Power: 0.1W; Case EIA: 0603; Case Metric: 1608; Maximum Working Voltage: 75V; PnP Package: R_0603; Automotive Qualified: False; Part Number: gen_R_270R_0603; Operating Temperature: -55°C - +155°C; Resistance: 270R; Series: E24; PnP Value: 270R; Supplier 1: Farnell; Supplier Part Number 1: 2141320
R1415-1 R1416-1 R1419-1 = gen_R_1k21_0603: SMD Resistor 1k21 0603; Tolerance: 1%; Power: 0.1W; Case EIA: 0603; Case Metric: 1608; Maximum Working Voltage: 75V; PnP Package: R_0603; Automotive Qualified: False; Part Number: gen_R_1k21_0603; Operating Temperature: -55°C - +155°C; Resistance: 1k21; Series: E96; PnP Value: 1k21; Supplier 1: Farnell; Supplier Part Number 1: 1652852
R1421-1 = gen_R_820R_0603: SMD Resistor 820R 0603; Tolerance: 1%; Power: 0.1W; Case EIA: 0603; Case Metric: 1608; Maximum Working Voltage: 75V; PnP Package: R_0603; Automotive Qualified: False; Part Number: gen_R_820R_0603; Operating Temperature: -55°C - +155°C; Resistance: 820R; Series: E24; PnP Value: 820R; Supplier 1: Farnell; Supplier Part Number 1: 1469841
R1422-1 R1423-1 = gen_R_120R_0603: SMD Resistor 120R 0603; Tolerance: 1%; Power: 0.1W; Case EIA: 0603; Case Metric: 1608; Maximum Working Voltage: 75V; PnP Package: R_0603; Automotive Qualified: False; Part Number: gen_R_120R_0603; Operating Temperature: -55°C - +155°C; Resistance: 120R; Series: E24; PnP Value: 120R; Supplier 1: Farnell; Supplier Part Number 1: 2073369
TP1400-1 TP1401-1 TP1402-1 TP1403-1 TP1404-1 TP1405-1 TP1406-1 TP1407-1 = Testpoint_Square: Testpoint, square; Part Number: Testpoint_Square
TR1400-1 = HM2102NL: Pulse HM2102NL BMS Transformer; Automotive Qualified: True; Part Number: HM2102NL; Manufacturer: Pulse; Operating Temperature: -40°C - +125°C; ComponentLink1Description: Datasheet; ComponentLink1URL: https://www.mouser.com/ds/2/336/HM2102NL-1218600.pdf; Supplier 1: Mouser; Supplier Part Number 1: 673-HM2102NL; Supplier 2: Digikey; Supplier Part Number 2: 1840-1034-1-ND

## Sheet secondary_LTC.SchDoc: foxBMS BMS-Slave 12-Cell
size A3; DocumentNumber: 21; SheetNumber: 21; SheetTotal: 21; AUTHOR: Fraunhofer IISB foxBMS Team; SheetDescription: Secondary LTC6811
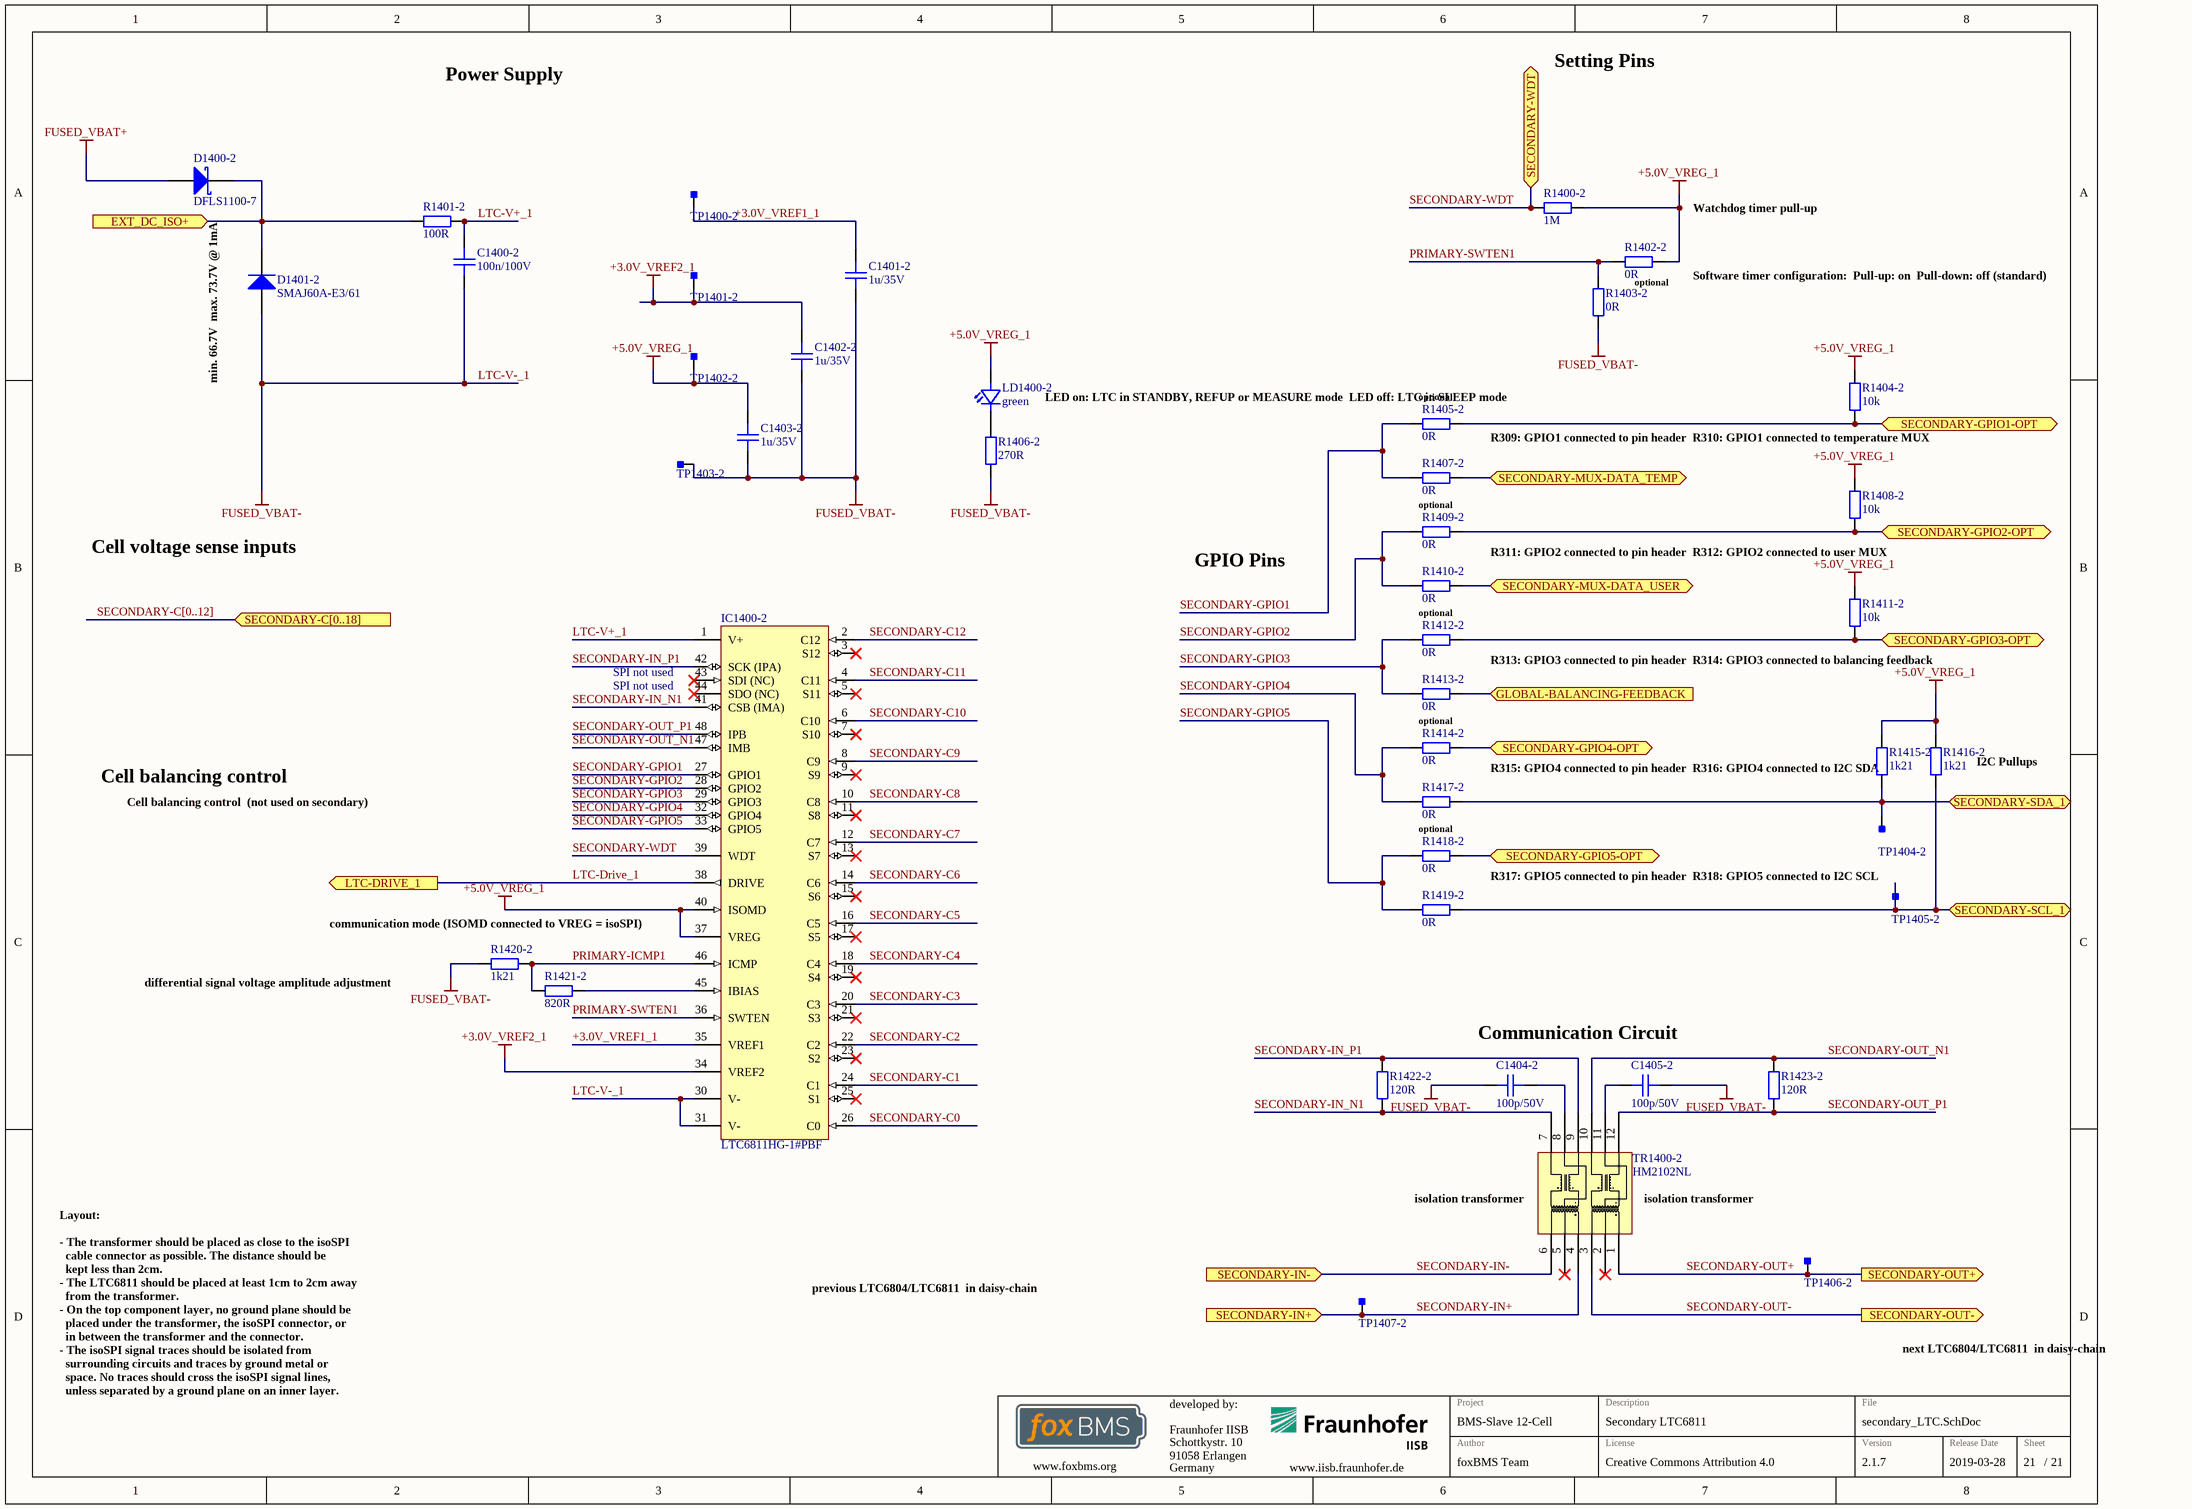
[diagram p9: secondary_LTC.SchDoc]

### Parts
C1400-2  100n/100V  [CAPC2012X14N]
C1401-2  1u/35V  [CAPC1608X08N]
C1402-2  1u/35V  [CAPC1608X08N]
C1403-2  1u/35V  [CAPC1608X08N]
C1404-2  100p/50V  [CAPC1608X08N]
C1405-2  100p/50V  [CAPC1608X08N]
D1400-2  DFLS1100-7  [DIOD-POWERDI123-2_V]
D1401-2  SMAJ60A-E3/61  [VISH-DO-214AC-2_N]
IC1400-2  LTC6811HG-1#PBF  [LT-G-48_L]
LD1400-2  green  [LEDC1608X07N]
R1400-2  1M  [RESC1608X05N]
R1401-2  100R  [RESC2012X05N]
R1402-2  0R  [RESC1608X05N]
R1403-2  0R  [RESC1608X05N]
R1404-2  10k  [RESC1608X05N]
R1405-2  0R  [RESC1608X05N]
R1406-2  270R  [RESC1608X05N]
R1407-2  0R  [RESC1608X05N]
R1408-2  10k  [RESC1608X05N]
R1409-2  0R  [RESC1608X05N]
R1410-2  0R  [RESC1608X05N]
R1411-2  10k  [RESC1608X05N]
R1412-2  0R  [RESC1608X05N]
R1413-2  0R  [RESC1608X05N]
R1414-2  0R  [RESC1608X05N]
R1415-2  1k21  [RESC1608X05N]
R1416-2  1k21  [RESC1608X05N]
R1417-2  0R  [RESC1608X05N]
R1418-2  0R  [RESC1608X05N]
R1419-2  0R  [RESC1608X05N]
R1420-2  1k21  [RESC1608X05N]
R1421-2  820R  [RESC1608X05N]
R1422-2  120R  [RESC1608X05N]
R1423-2  120R  [RESC1608X05N]
TP1400-2  Testpoint_Square  [Testpoint_S1]  (value not drawn)  (no BOM)
TP1401-2  Testpoint_Square  [Testpoint_S1]  (value not drawn)  (no BOM)
TP1402-2  Testpoint_Square  [Testpoint_S1]  (value not drawn)  (no BOM)
TP1403-2  Testpoint_Square  [Testpoint_S1]  (value not drawn)  (no BOM)
TP1404-2  Testpoint_Square  [Testpoint_S1]  (value not drawn)  (no BOM)
TP1405-2  Testpoint_Square  [Testpoint_S1]  (value not drawn)  (no BOM)
TP1406-2  Testpoint_Square  [Testpoint_S1]  (value not drawn)  (no BOM)
TP1407-2  Testpoint_Square  [Testpoint_S1]  (value not drawn)  (no BOM)
TR1400-2  HM2102NL  [HM2102NL]

### Ports
EXT_DC_ISO+ (in), GLOBAL-BALANCING-FEEDBACK (in), LTC-DRIVE_1 (out), SECONDARY-C[0..18] (in), SECONDARY-GPIO1-OPT (bidir), SECONDARY-GPIO2-OPT (bidir), SECONDARY-GPIO3-OPT (bidir), SECONDARY-GPIO4-OPT (bidir), SECONDARY-GPIO5-OPT (bidir), SECONDARY-IN+ (in), SECONDARY-IN- (in), SECONDARY-MUX-DATA_TEMP (bidir), SECONDARY-MUX-DATA_USER (bidir), SECONDARY-OUT+ (out), SECONDARY-OUT- (out), SECONDARY-SCL_1 (bidir), SECONDARY-SDA_1 (bidir), SECONDARY-WDT (bidir)

### Nets
+3.0V_VREF2_1: C1402-2.2 IC1400-2.34(VREF2) TP1401-2.1
+5.0V_VREG_1: C1403-2.2 IC1400-2.37(VREG) IC1400-2.40(ISOMD) LD1400-2.2(A) R1400-2.2 R1402-2.2 R1404-2.2 R1408-2.2 R1411-2.2 R1415-2.2 R1416-2.2 TP1402-2.1
FUSED_VBAT+: D1400-2.1(A)
FUSED_VBAT-: C1400-2.2 C1401-2.1 C1402-2.1 C1403-2.1 C1404-2.1 C1405-2.1 D1401-2.2(A) IC1400-2.30(V-) IC1400-2.31(V-) R1403-2.1 R1406-2.1 R1420-2.1 TP1403-2.1  [also labelled LTC-V-_1]
+3.0V_VREF1_1: C1401-2.2 IC1400-2.35(VREF1) TP1400-2.1
EXT_DC_ISO+: D1400-2.2(K) D1401-2.1(K) R1401-2.1 ; port EXT_DC_ISO+
GLOBAL-BALANCING-FEEDBACK: R1413-2.1 ; port GLOBAL-BALANCING-FEEDBACK
LTC-Drive_1: IC1400-2.38(DRIVE) ; port LTC-DRIVE_1
LTC-V+_1: C1400-2.1 IC1400-2.1(V+) R1401-2.2
PRIMARY-ICMP1: IC1400-2.46(ICMP) R1420-2.2 R1421-2.1
PRIMARY-SWTEN1: IC1400-2.36(SWTEN) R1402-2.1 R1403-2.2
SECONDARY-C0: IC1400-2.26(C0)
SECONDARY-C1: IC1400-2.24(C1)
SECONDARY-C2: IC1400-2.22(C2)
SECONDARY-C3: IC1400-2.20(C3)
SECONDARY-C4: IC1400-2.18(C4)
SECONDARY-C5: IC1400-2.16(C5)
SECONDARY-C6: IC1400-2.14(C6)
SECONDARY-C7: IC1400-2.12(C7)
SECONDARY-C8: IC1400-2.10(C8)
SECONDARY-C9: IC1400-2.8(C9)
SECONDARY-C10: IC1400-2.6(C10)
SECONDARY-C11: IC1400-2.4(C11)
SECONDARY-C12: IC1400-2.2(C12)
SECONDARY-GPIO1: IC1400-2.27(GPIO1) R1405-2.2 R1407-2.2
SECONDARY-GPIO1-OPT: R1404-2.1 R1405-2.1 ; port SECONDARY-GPIO1-OPT
SECONDARY-GPIO2: IC1400-2.28(GPIO2) R1409-2.2 R1410-2.2
SECONDARY-GPIO2-OPT: R1408-2.1 R1409-2.1 ; port SECONDARY-GPIO2-OPT
SECONDARY-GPIO3: IC1400-2.29(GPIO3) R1412-2.2 R1413-2.2
SECONDARY-GPIO3-OPT: R1411-2.1 R1412-2.1 ; port SECONDARY-GPIO3-OPT
SECONDARY-GPIO4: IC1400-2.32(GPIO4) R1414-2.2 R1417-2.2
SECONDARY-GPIO4-OPT: R1414-2.1 ; port SECONDARY-GPIO4-OPT
SECONDARY-GPIO5: IC1400-2.33(GPIO5) R1418-2.2 R1419-2.2
SECONDARY-GPIO5-OPT: R1418-2.1 ; port SECONDARY-GPIO5-OPT
SECONDARY-IN+: TP1407-2.1 TR1400-2.4 ; port SECONDARY-IN+
SECONDARY-IN-: TR1400-2.6 ; port SECONDARY-IN-
SECONDARY-IN_N1: IC1400-2.41(CSB_(IMA)) R1422-2.2 TR1400-2.7
SECONDARY-IN_P1: IC1400-2.42(SCK_(IPA)) R1422-2.1 TR1400-2.9
SECONDARY-MUX-DATA_TEMP: R1407-2.1 ; port SECONDARY-MUX-DATA_TEMP
SECONDARY-MUX-DATA_USER: R1410-2.1 ; port SECONDARY-MUX-DATA_USER
SECONDARY-OUT+: TP1406-2.1 TR1400-2.1 ; port SECONDARY-OUT+
SECONDARY-OUT-: TR1400-2.3 ; port SECONDARY-OUT-
SECONDARY-OUT_N1: IC1400-2.47(IMB) R1423-2.2 TR1400-2.10
SECONDARY-OUT_P1: IC1400-2.48(IPB) R1423-2.1 TR1400-2.12
SECONDARY-SCL_1: R1416-2.1 R1419-2.1 TP1405-2.1 ; port SECONDARY-SCL_1
SECONDARY-SDA_1: R1415-2.1 R1417-2.1 TP1404-2.1 ; port SECONDARY-SDA_1
SECONDARY-WDT: IC1400-2.39(WDT) R1400-2.1 ; port SECONDARY-WDT
NetC1404-2_2: C1404-2.2 TR1400-2.8
NetC1405-2_2: C1405-2.2 TR1400-2.11
NetIC1400-2_45: IC1400-2.45(IBIAS) R1421-2.2
NetLD1400-2_1: LD1400-2.1(C) R1406-2.2

Not connected (* = marked no-connect by the designer): IC1400-2 3(S12)* 5(S11)* 7(S10)* 9(S9)* 11(S8)* 13(S7)* 15(S6)* 17(S5)* 19(S4)* 21(S3)* 23(S2)* 25(S1)* 43(SDI_(NC))* 44(SDO_(NC))*; TR1400-2 2* 5*

### Buses and harness runs
bus SECONDARY-C[0..12] = port SECONDARY-C[0..18]

### Notes on the sheet
- Power Supply
- Setting Pins
- Watchdog timer pull-up
- min. 66.7V
  max. 73.7V @ 1mA
- (near R1402-2) optional
- (near R1402-2) Software timer configuration:
  Pull-up: on
  Pull-down: off (standard)
- (near R1405-2) LED on: LTC in STANDBY, REFUP or MEASURE mode
  LED off: LTC in SLEEP mode
- (near R1405-2) optional
- (near R1404-2) R309: GPIO1 connected to pin header
  R310: GPIO1 connected to temperature MUX
- optional
- Cell voltage sense inputs
- GPIO Pins
- R311: GPIO2 connected to pin header
  R312: GPIO2 connected to user MUX
- (near IC1400-2) SPI not used
- R313: GPIO3 connected to pin header
  R314: GPIO3 connected to balancing feedback
- Cell balancing control
- (near R1415-2) R315: GPIO4 connected to pin header
  R316: GPIO4 connected to I2C SDA
- (near R1416-2) I2C Pullups
- Cell balancing control
  (not used on secondary)
- (near R1420-2) communication mode (ISOMD connected to VREG = isoSPI)
- (near TP1405-2) R317: GPIO5 connected to pin header
  R318: GPIO5 connected to I2C SCL
- differential signal voltage amplitude adjustment
- Communication Circuit
- (near TR1400-2) isolation transformer
- previous LTC6804/LTC6811
  in daisy-chain
- next LTC6804/LTC6811
  in daisy-chain
- Layout:
  - The transformer should be placed as close to the isoSPI
  cable connector as possible. The distance should be
  kept less than 2cm.
  - The LTC6811 should be placed at least 1cm to 2cm away
  from the transformer.
  - On the top component layer, no ground plane should be
  placed under the transformer, the isoSPI connector, or
  in between the transformer and the connector.
  - The isoSPI signal traces should be isolated from
  surrounding circuits and traces by ground metal or
  space. No traces should cross the isoSPI signal lines,
  unless separated by a ground plane on an inner layer.
- Fraunhofer IISB
- Schottkystr. 10
- developed by:
- 91058 Erlangen
- Germany
- Author
- Project
- License
- Description
- File
- Version
- Release Date
- Sheet
- www.foxbms.org
- www.iisb.fraunhofer.de
- foxBMS Team
- /

### Library data of the parts
C1400-2 = gen_C_ceramic_100n_100V_X7R_0805: as C1400-1 on sheet primary_LTC; Part Number: gen_C_ceramic_100n_100V_X7R_0805; Supplier 1: Farnell; Supplier Part Number 1: 2320821
C1401-2 C1402-2 C1403-2 = gen_C_ceramic_1u_35V_X7R_0603: as C1401-1 on sheet primary_LTC; Part Number: gen_C_ceramic_1u_35V_X7R_0603; Supplier 1: Farnell; Supplier Part Number 1: 1907508
C1404-2 C1405-2 = gen_C_ceramic_100p_50V_C0G_0603: as C1404-1 on sheet primary_LTC; Part Number: gen_C_ceramic_100p_50V_C0G_0603; Supplier 1: Farnell; Supplier Part Number 1: 1414603
D1400-2 = CMP-2000-05099-1: as D1400-1 on sheet primary_LTC; Datasheet Version: Sep-14; Datasheet URL: https://datasheet.ciiva.com/15144/getdatasheetpartid-44146-15144126.pdf; Manufacturer URL: http://www.diodes.com/
D1401-2 = CMP-0548-00258-2: as D1401-1 on sheet primary_LTC; RoHS: TRUE; ComponentLink3Description: Package Specification; PackageReference: DO-214AC-2; PartNumber: SMAJ60A-E3/61; ComponentLink2Description: Datasheet; ComponentLink2URL: http://www.vishay.com/docs/88390/smaj50a.pdf; ComponentLink3URL: http://www.vishay.com/docs/88390/smaj50a.pdf; Packing: Tape and Reel; ComponentLink1Description: Manufacturer URL; PackageDescription: 2-Pin DO-214AC (SMA), Body 4.245 x 2.665 mm; DatasheetVersion: 12/8/2013; ComponentLink1URL: http://www.vishay.com/; Operating Junction and Storage Temperature Range: -55 to 150 degC; Mounting Technology: Surface Mount
IC1400-2 = LTC6811HG-1#PBF: as IC1400-1 on sheet primary_LTC; RoHS: TRUE; ComponentLink1Description: Datasheet; ComponentLink1URL: https://cds.linear.com/docs/en/datasheet/68111fb.pdf; PartNumber: LTC6811HG-1#PBF; PackageReference: G-48; PackageVersion: Rev. Ã˜, 01/2011; ComponentLink2Description: Datasheet; Mounting Technology: Surface Mount; ComponentLink3Description: Package Specification; PackageDescription: 48-Pin Plastic SSOP, Body 12.8 x 5.3 mm, Pitch 0.5 mm; ComponentLink3URL: http://cds.linear.com/docs/en/packaging/05081887_0_G48.pdf; ComponentLink2URL: http://cds.linear.com/docs/en/datasheet/680412f.pdf; Part Number: LTC6811HG-1#PBF; Part Name: LTC6811HG-1#PBF; Operating Temperature: -40°C - +125°C; Supplier 1: Digikey; Supplier Part Number 1: LTC6811HG-1#PBF-ND
LD1400-2 = gen_LED_0603_green: as LD1400-1 on sheet primary_LTC; Part Number: gen_LED_0603_green; Color: green; Supplier 1: Farnell; Supplier Part Number 1: 2099223; PnP Package: LED_0603
R1400-2 = gen_R_1M_0603: as R1401-1 on sheet primary_LTC; Part Number: gen_R_1M_0603; Operating Temperature: -55°C - +155°C; Resistance: 1M; Series: E24, E96; PnP Value: 1M; Supplier 1: Farnell; Supplier Part Number 1: 1469746
R1401-2 = gen_R_100R_0805: as R1400-1 on sheet primary_LTC; Part Number: gen_R_100R_0805; Operating Temperature: -55°C - +155°C; Resistance: 100R; Series: E24, E96; PnP Value: 100R; Supplier 1: Farnell; Supplier Part Number 1: 1469862
R1402-2 R1403-2 R1405-2 R1407-2 R1409-2 R1410-2 R1412-2 R1413-2 R1414-2 R1417-2 R1418-2 R1419-2 = gen_R_0R_0603: as R1402-1 on sheet primary_LTC; Part Number: gen_R_0R_0603; Operating Temperature: -55°C - +155°C; Resistance: 0R; Series: Jumper; PnP Value: 0R; Supplier 1: Farnell; Supplier Part Number 1: 2073345
R1404-2 R1408-2 R1411-2 = gen_R_10k_0603: as R1404-1 on sheet primary_LTC; Part Number: gen_R_10k_0603; Operating Temperature: -55°C - +155°C; Resistance: 10k; Series: E24, E96; PnP Value: 10k; Supplier 1: Farnell; Supplier Part Number 1: 2073349
R1406-2 = gen_R_270R_0603: as R1407-1 on sheet primary_LTC; Part Number: gen_R_270R_0603; Operating Temperature: -55°C - +155°C; Resistance: 270R; Series: E24; PnP Value: 270R; Supplier 1: Farnell; Supplier Part Number 1: 2141320
R1415-2 R1416-2 R1420-2 = gen_R_1k21_0603: as R1415-1 on sheet primary_LTC; Part Number: gen_R_1k21_0603; Operating Temperature: -55°C - +155°C; Resistance: 1k21; Series: E96; PnP Value: 1k21; Supplier 1: Farnell; Supplier Part Number 1: 1652852
R1421-2 = gen_R_820R_0603: as R1421-1 on sheet primary_LTC; Part Number: gen_R_820R_0603; Operating Temperature: -55°C - +155°C; Resistance: 820R; Series: E24; PnP Value: 820R; Supplier 1: Farnell; Supplier Part Number 1: 1469841
R1422-2 R1423-2 = gen_R_120R_0603: as R1422-1 on sheet primary_LTC; Part Number: gen_R_120R_0603; Operating Temperature: -55°C - +155°C; Resistance: 120R; Series: E24; PnP Value: 120R; Supplier 1: Farnell; Supplier Part Number 1: 2073369
TP1400-2 TP1401-2 TP1402-2 TP1403-2 TP1404-2 TP1405-2 TP1406-2 TP1407-2 = Testpoint_Square: Testpoint, square; Part Number: Testpoint_Square
TR1400-2 = HM2102NL: as TR1400-1 on sheet primary_LTC; Part Number: HM2102NL; Manufacturer: Pulse; Operating Temperature: -40°C - +125°C; ComponentLink1Description: Datasheet; ComponentLink1URL: https://www.mouser.com/ds/2/336/HM2102NL-1218600.pdf; Supplier 1: Mouser; Supplier Part Number 1: 673-HM2102NL; Supplier 2: Digikey; Supplier Part Number 2: 1840-1034-1-ND

## Sheet primary_DIO.SchDoc: foxBMS BMS-Slave 12-Cell
size A3; DocumentNumber: 13; SheetNumber: 13; SheetTotal: 21; AUTHOR: Fraunhofer IISB foxBMS Team; SheetDescription: Primary Digital Inputs/Outputs
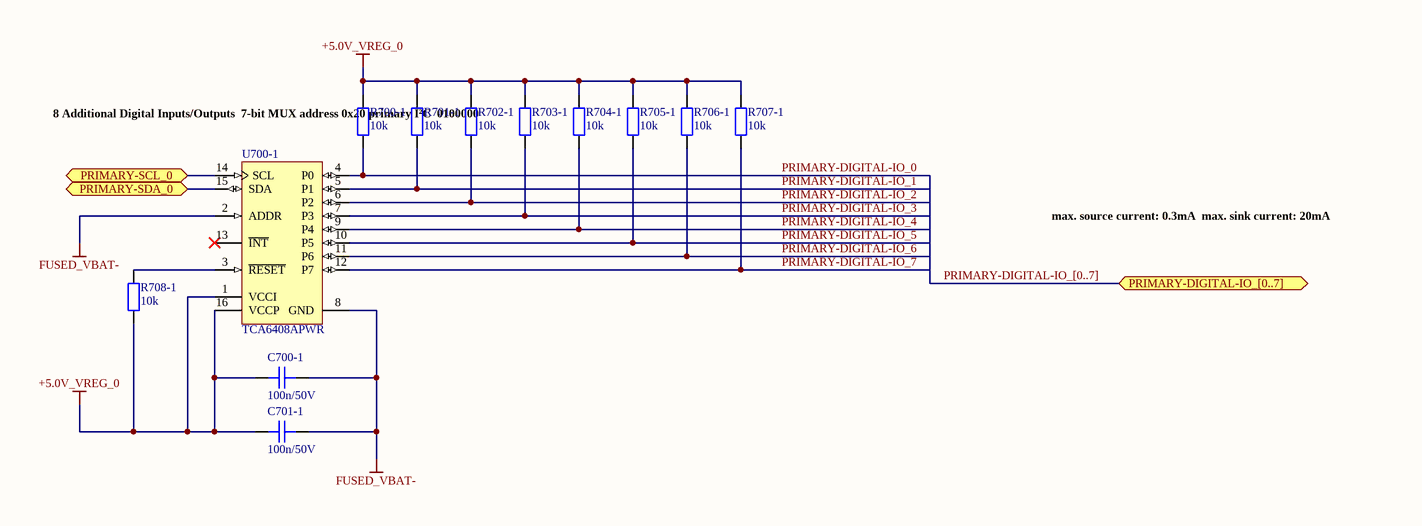
[diagram p10: primary_DIO.SchDoc]

### Parts
C700-1  100n/50V  [CAPC1608X08N]
C701-1  100n/50V  [CAPC1608X08N]
R700-1  10k  [RESC1608X05N]
R701-1  10k  [RESC1608X05N]
R702-1  10k  [RESC1608X05N]
R703-1  10k  [RESC1608X05N]
R704-1  10k  [RESC1608X05N]
R705-1  10k  [RESC1608X05N]
R706-1  10k  [RESC1608X05N]
R707-1  10k  [RESC1608X05N]
R708-1  10k  [RESC1608X05N]
U700-1  TCA6408APWR  [PW0016A_L]

### Ports
PRIMARY-DIGITAL-IO_[0..7] (bidir), PRIMARY-SCL_0 (bidir), PRIMARY-SDA_0 (bidir)

### Nets
+5.0V_VREG_0: C700-1.2 C701-1.2 R700-1.2 R701-1.2 R702-1.2 R703-1.2 R704-1.2 R705-1.2 R706-1.2 R707-1.2 R708-1.1 U700-1.1(VCCI) U700-1.16(VCCP)
FUSED_VBAT-: C700-1.1 C701-1.1 U700-1.2(ADDR) U700-1.8(GND)
PRIMARY-DIGITAL-IO_0: R700-1.1 U700-1.4(P0)
PRIMARY-DIGITAL-IO_1: R701-1.1 U700-1.5(P1)
PRIMARY-DIGITAL-IO_2: R702-1.1 U700-1.6(P2)
PRIMARY-DIGITAL-IO_3: R703-1.1 U700-1.7(P3)
PRIMARY-DIGITAL-IO_4: R704-1.1 U700-1.9(P4)
PRIMARY-DIGITAL-IO_5: R705-1.1 U700-1.10(P5)
PRIMARY-DIGITAL-IO_6: R706-1.1 U700-1.11(P6)
PRIMARY-DIGITAL-IO_7: R707-1.1 U700-1.12(P7)
PRIMARY-SCL_0: U700-1.14(SCL) ; port PRIMARY-SCL_0
PRIMARY-SDA_0: U700-1.15(SDA) ; port PRIMARY-SDA_0
NetR708-1_2: R708-1.2 U700-1.3(~{RESET})

Not connected (* = marked no-connect by the designer): U700-1 13(~{INT})*

### Buses and harness runs
bus PRIMARY-DIGITAL-IO_[0..7] = port PRIMARY-DIGITAL-IO_[0..7]

### Notes on the sheet
- 8 Additional Digital Inputs/Outputs
  7-bit MUX address 0x20 primary I²C
  0100000
- max. source current: 0.3mA
  max. sink current: 20mA
- Fraunhofer IISB
- Schottkystr. 10
- developed by:
- 91058 Erlangen
- Germany
- Author
- Project
- License
- Description
- File
- Version
- Release Date
- Sheet
- www.foxbms.org
- www.iisb.fraunhofer.de
- foxBMS Team
- /

### Library data of the parts
C700-1 C701-1 = gen_C_ceramic_100n_50V_X7R_0603: MLCC; Capacitance: 100n; Rated Voltage: 50V; Dielectric: X7R; Case EIA: 0603; Case Metric: 1608; PnP Package: C_0603_10; PnP Value: 100n/50V/X7R; PnP equipped: x; Automotive Qualified: True; Part Number: gen_C_ceramic_100n_50V_X7R_0603; Supplier 1: Farnell; Supplier Part Number 1: 2525267; Supplier 2: Digikey; Supplier Part Number 2: 490-6049-1-ND; Supplier 3: Farnell; Supplier Part Number 3: 2070398
R700-1 R701-1 R702-1 R703-1 R704-1 R705-1 R706-1 R707-1 = gen_R_10k_0603: SMD Resistor 10k 0603; Tolerance: 1%; Power: 0.1W; Case EIA: 0603; Case Metric: 1608; Maximum Working Voltage: 75V; PnP Package: R_0603; Automotive Qualified: False; Part Number: gen_R_10k_0603; Operating Temperature: -55°C - +155°C; Resistance: 10k; Series: E24, E96; PnP Value: 10k; Supplier 1: Farnell; Supplier Part Number 1: 2073349
R708-1 = gen_R_10k_0603: as R1404-1 on sheet primary_LTC; Part Number: gen_R_10k_0603; Operating Temperature: -55°C - +155°C; Resistance: 10k; Series: E24, E96; PnP Value: 10k; Supplier 1: Farnell; Supplier Part Number 1: 2073349
U700-1 = CMP-0314-00338-2: Low-Voltage 8-Bit I2C and SMBus I/O Expander, 1.65 to 5.5 V, -40 to 85 degC, 16-pin TSSOP (PW), Green (RoHS & no Sb/Br); Manufacturer: Texas Instruments; Push-Pull I/O Type: Yes; Max Frequency(kHz): 400; No. of Outputs: 8; VCC(Min)(V): 1.65; SubFamily: I2C IO Expander; I2C Address: 0100 00x; VCC(Max)(V): 5.5; Vcc range(V): 1.65 to 5.5; PackageDescription: 16-Pin Plastic Thin Small Outline Package 5 x 4.4 mm Body ,0.65 mm Pitch; PartNumber: TCA6408APWR; Configuration Registers: Yes; Eco-Plan: Green (RoHS & no Sb/Br); ComponentLink1Description: Datasheet; Low Power: Yes; ComponentLink1URL: http://www.ti.com/general/docs/lit/getliterature.tsp?genericPartNumber=TCA6408A&fileType=pdf; 5V Tolerant I/O: Yes; Code_JEDEC: MO-153; Interrupt Output: Yes; PackageVersion: revG, Feb-2011; # of I/Os: 8; Reset Input: Yes; fSCLK(Max)(MHz): 400; PackageReference: PW0016A; Mounting Technology: Surface Mount; DatasheetVersion: SCPS192C

## Sheet secondary_DIO.SchDoc: foxBMS BMS-Slave 12-Cell
size A3; DocumentNumber: 19; SheetNumber: 19; SheetTotal: 21; AUTHOR: Fraunhofer IISB foxBMS Team; SheetDescription: Secondary Digital Inputs/Outputs
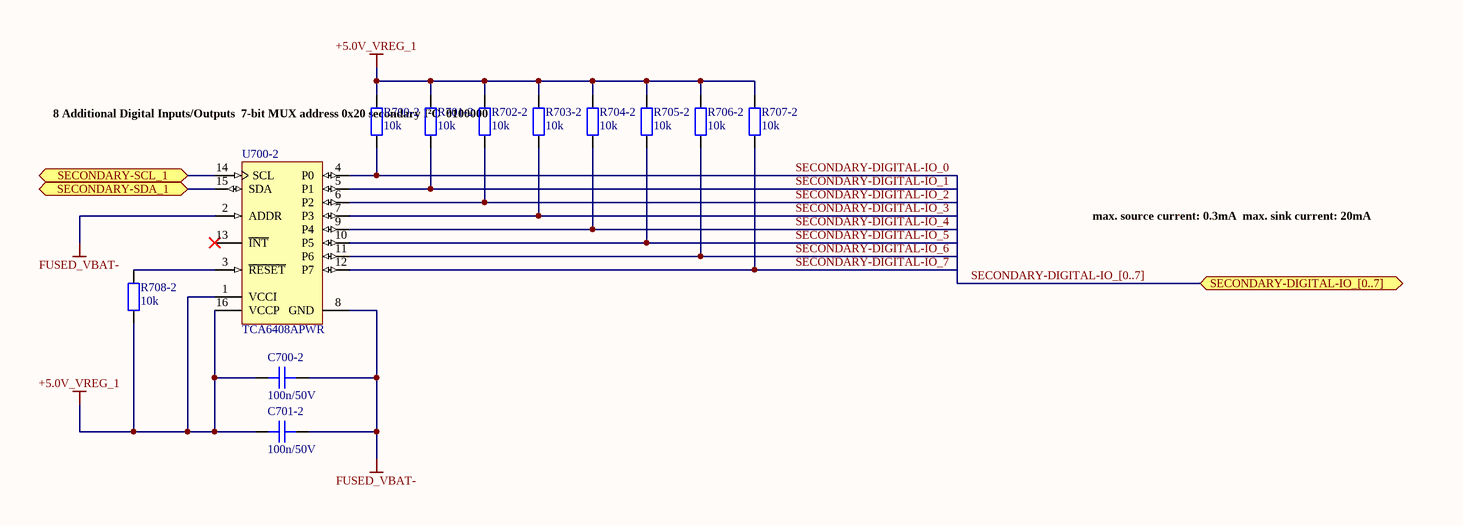
[diagram p11: secondary_DIO.SchDoc]

### Parts
C700-2  100n/50V  [CAPC1608X08N]
C701-2  100n/50V  [CAPC1608X08N]
R700-2  10k  [RESC1608X05N]
R701-2  10k  [RESC1608X05N]
R702-2  10k  [RESC1608X05N]
R703-2  10k  [RESC1608X05N]
R704-2  10k  [RESC1608X05N]
R705-2  10k  [RESC1608X05N]
R706-2  10k  [RESC1608X05N]
R707-2  10k  [RESC1608X05N]
R708-2  10k  [RESC1608X05N]
U700-2  TCA6408APWR  [PW0016A_L]

### Ports
SECONDARY-DIGITAL-IO_[0..7] (bidir), SECONDARY-SCL_1 (bidir), SECONDARY-SDA_1 (bidir)

### Nets
+5.0V_VREG_1: C700-2.2 C701-2.2 R700-2.2 R701-2.2 R702-2.2 R703-2.2 R704-2.2 R705-2.2 R706-2.2 R707-2.2 R708-2.1 U700-2.1(VCCI) U700-2.16(VCCP)
FUSED_VBAT-: C700-2.1 C701-2.1 U700-2.2(ADDR) U700-2.8(GND)
SECONDARY-DIGITAL-IO_0: R700-2.1 U700-2.4(P0)
SECONDARY-DIGITAL-IO_1: R701-2.1 U700-2.5(P1)
SECONDARY-DIGITAL-IO_2: R702-2.1 U700-2.6(P2)
SECONDARY-DIGITAL-IO_3: R703-2.1 U700-2.7(P3)
SECONDARY-DIGITAL-IO_4: R704-2.1 U700-2.9(P4)
SECONDARY-DIGITAL-IO_5: R705-2.1 U700-2.10(P5)
SECONDARY-DIGITAL-IO_6: R706-2.1 U700-2.11(P6)
SECONDARY-DIGITAL-IO_7: R707-2.1 U700-2.12(P7)
SECONDARY-SCL_1: U700-2.14(SCL) ; port SECONDARY-SCL_1
SECONDARY-SDA_1: U700-2.15(SDA) ; port SECONDARY-SDA_1
NetR708-2_2: R708-2.2 U700-2.3(~{RESET})

Not connected (* = marked no-connect by the designer): U700-2 13(~{INT})*

### Buses and harness runs
bus SECONDARY-DIGITAL-IO_[0..7] = port SECONDARY-DIGITAL-IO_[0..7]

### Notes on the sheet
- 8 Additional Digital Inputs/Outputs
  7-bit MUX address 0x20 secondary I²C
  0100000
- max. source current: 0.3mA
  max. sink current: 20mA
- Fraunhofer IISB
- Schottkystr. 10
- developed by:
- 91058 Erlangen
- Germany
- Author
- Project
- License
- Description
- File
- Version
- Release Date
- Sheet
- www.foxbms.org
- www.iisb.fraunhofer.de
- foxBMS Team
- /

### Library data of the parts
C700-2 C701-2 = gen_C_ceramic_100n_50V_X7R_0603: as C700-1 on sheet primary_DIO; Part Number: gen_C_ceramic_100n_50V_X7R_0603; Supplier 1: Farnell; Supplier Part Number 1: 2525267; Supplier 2: Digikey; Supplier Part Number 2: 490-6049-1-ND; Supplier 3: Farnell; Supplier Part Number 3: 2070398
R700-2 R701-2 R702-2 R703-2 R704-2 R705-2 R706-2 R707-2 = gen_R_10k_0603: as R700-1 on sheet primary_DIO; Part Number: gen_R_10k_0603; Operating Temperature: -55°C - +155°C; Resistance: 10k; Series: E24, E96; PnP Value: 10k; Supplier 1: Farnell; Supplier Part Number 1: 2073349
R708-2 = gen_R_10k_0603: as R1404-1 on sheet primary_LTC; Part Number: gen_R_10k_0603; Operating Temperature: -55°C - +155°C; Resistance: 10k; Series: E24, E96; PnP Value: 10k; Supplier 1: Farnell; Supplier Part Number 1: 2073349
U700-2 = CMP-0314-00338-2: as U700-1 on sheet primary_DIO; Vcc range(V): 1.65 to 5.5; PackageDescription: 16-Pin Plastic Thin Small Outline Package 5 x 4.4 mm Body ,0.65 mm Pitch; PartNumber: TCA6408APWR; Configuration Registers: Yes; Eco-Plan: Green (RoHS & no Sb/Br); ComponentLink1Description: Datasheet; Low Power: Yes; ComponentLink1URL: http://www.ti.com/general/docs/lit/getliterature.tsp?genericPartNumber=TCA6408A&fileType=pdf; 5V Tolerant I/O: Yes; Code_JEDEC: MO-153; Interrupt Output: Yes; PackageVersion: revG, Feb-2011; # of I/Os: 8; Reset Input: Yes; fSCLK(Max)(MHz): 400; PackageReference: PW0016A; Mounting Technology: Surface Mount; DatasheetVersion: SCPS192C